# EAGLE design xmosxl (EAGLE 9.6.2)

## Sheet 1 of 9: Overview
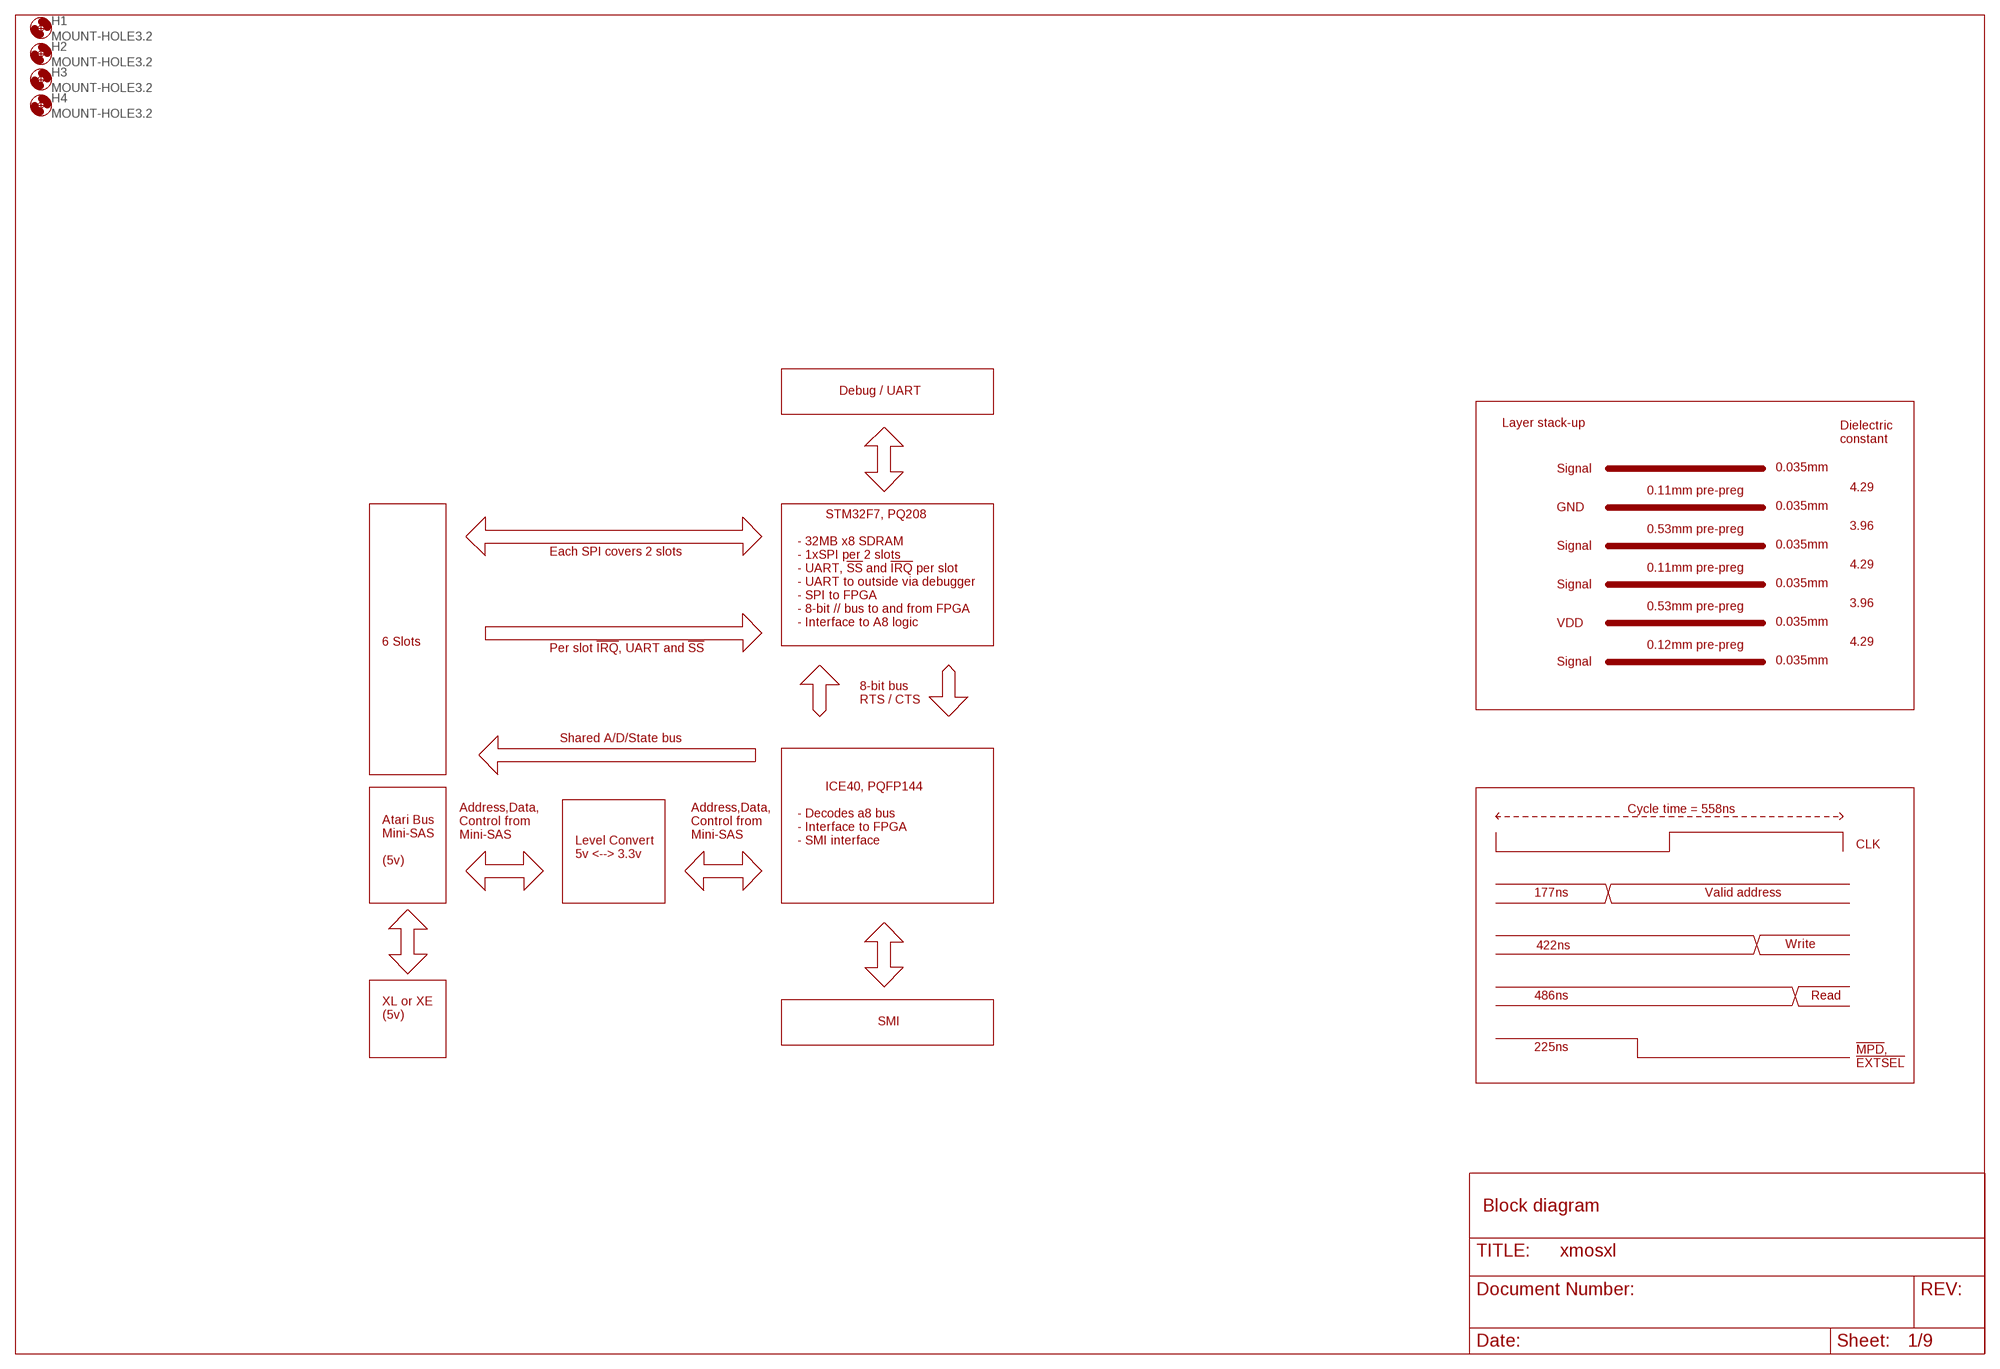
[diagram p0: schematic, sheet 1]

### Parts
H1  MOUNT-HOLE3.2  [3,2]
H2  MOUNT-HOLE3.2  [3,2]
H3  MOUNT-HOLE3.2  [3,2]
H4  MOUNT-HOLE3.2  [3,2]

### Notes on the sheet
- Debug / UART
- Layer stack-up
- Dielectric
  constant
- Signal | 0.035mm
- 0.11mm pre-preg | 4.29
- GND | 0.035mm
- 0.53mm pre-preg | 3.96
- Signal | 0.035mm
- Each SPI covers 2 slots
- 0.11mm pre-preg | 4.29
- Signal | 0.035mm
- 0.53mm pre-preg | 3.96
- 0.035mm
- STM32F7, PQ208
  
   - 32MB x8 SDRAM
   - 1xSPI per 2 slots
   - UART, !SS! and !IRQ! per slot
   - UART to outside via debugger
   - SPI to FPGA
   - 8-bit // bus to and from FPGA
   - Interface to A8 logic
- VDD
- 6 Slots | 0.12mm pre-preg | 4.29
- Per slot !IRQ!, UART and !SS!
- Signal | 0.035mm
- 8-bit bus
  RTS / CTS
- Shared A/D/State bus
- Cycle time = 558ns
- Address,Data,
  Control from
  Mini-SAS
- Address,Data,
  Control from
  Mini-SAS
- CLK
- Level Convert
  5v <--> 3.3v
- ICE40, PQFP144
  
   - Decodes a8 bus
   - Interface to FPGA
   - SMI interface
- Atari Bus
  Mini-SAS
  
  (5v)
- 177ns | Valid address
- 422ns | Write
- 486ns | Read
- XL or XE
  (5v)
- SMI
- 225ns
- !MPD!,
  !EXTSEL!
- Block diagram

## Sheet 2 of 9: A8 i/o
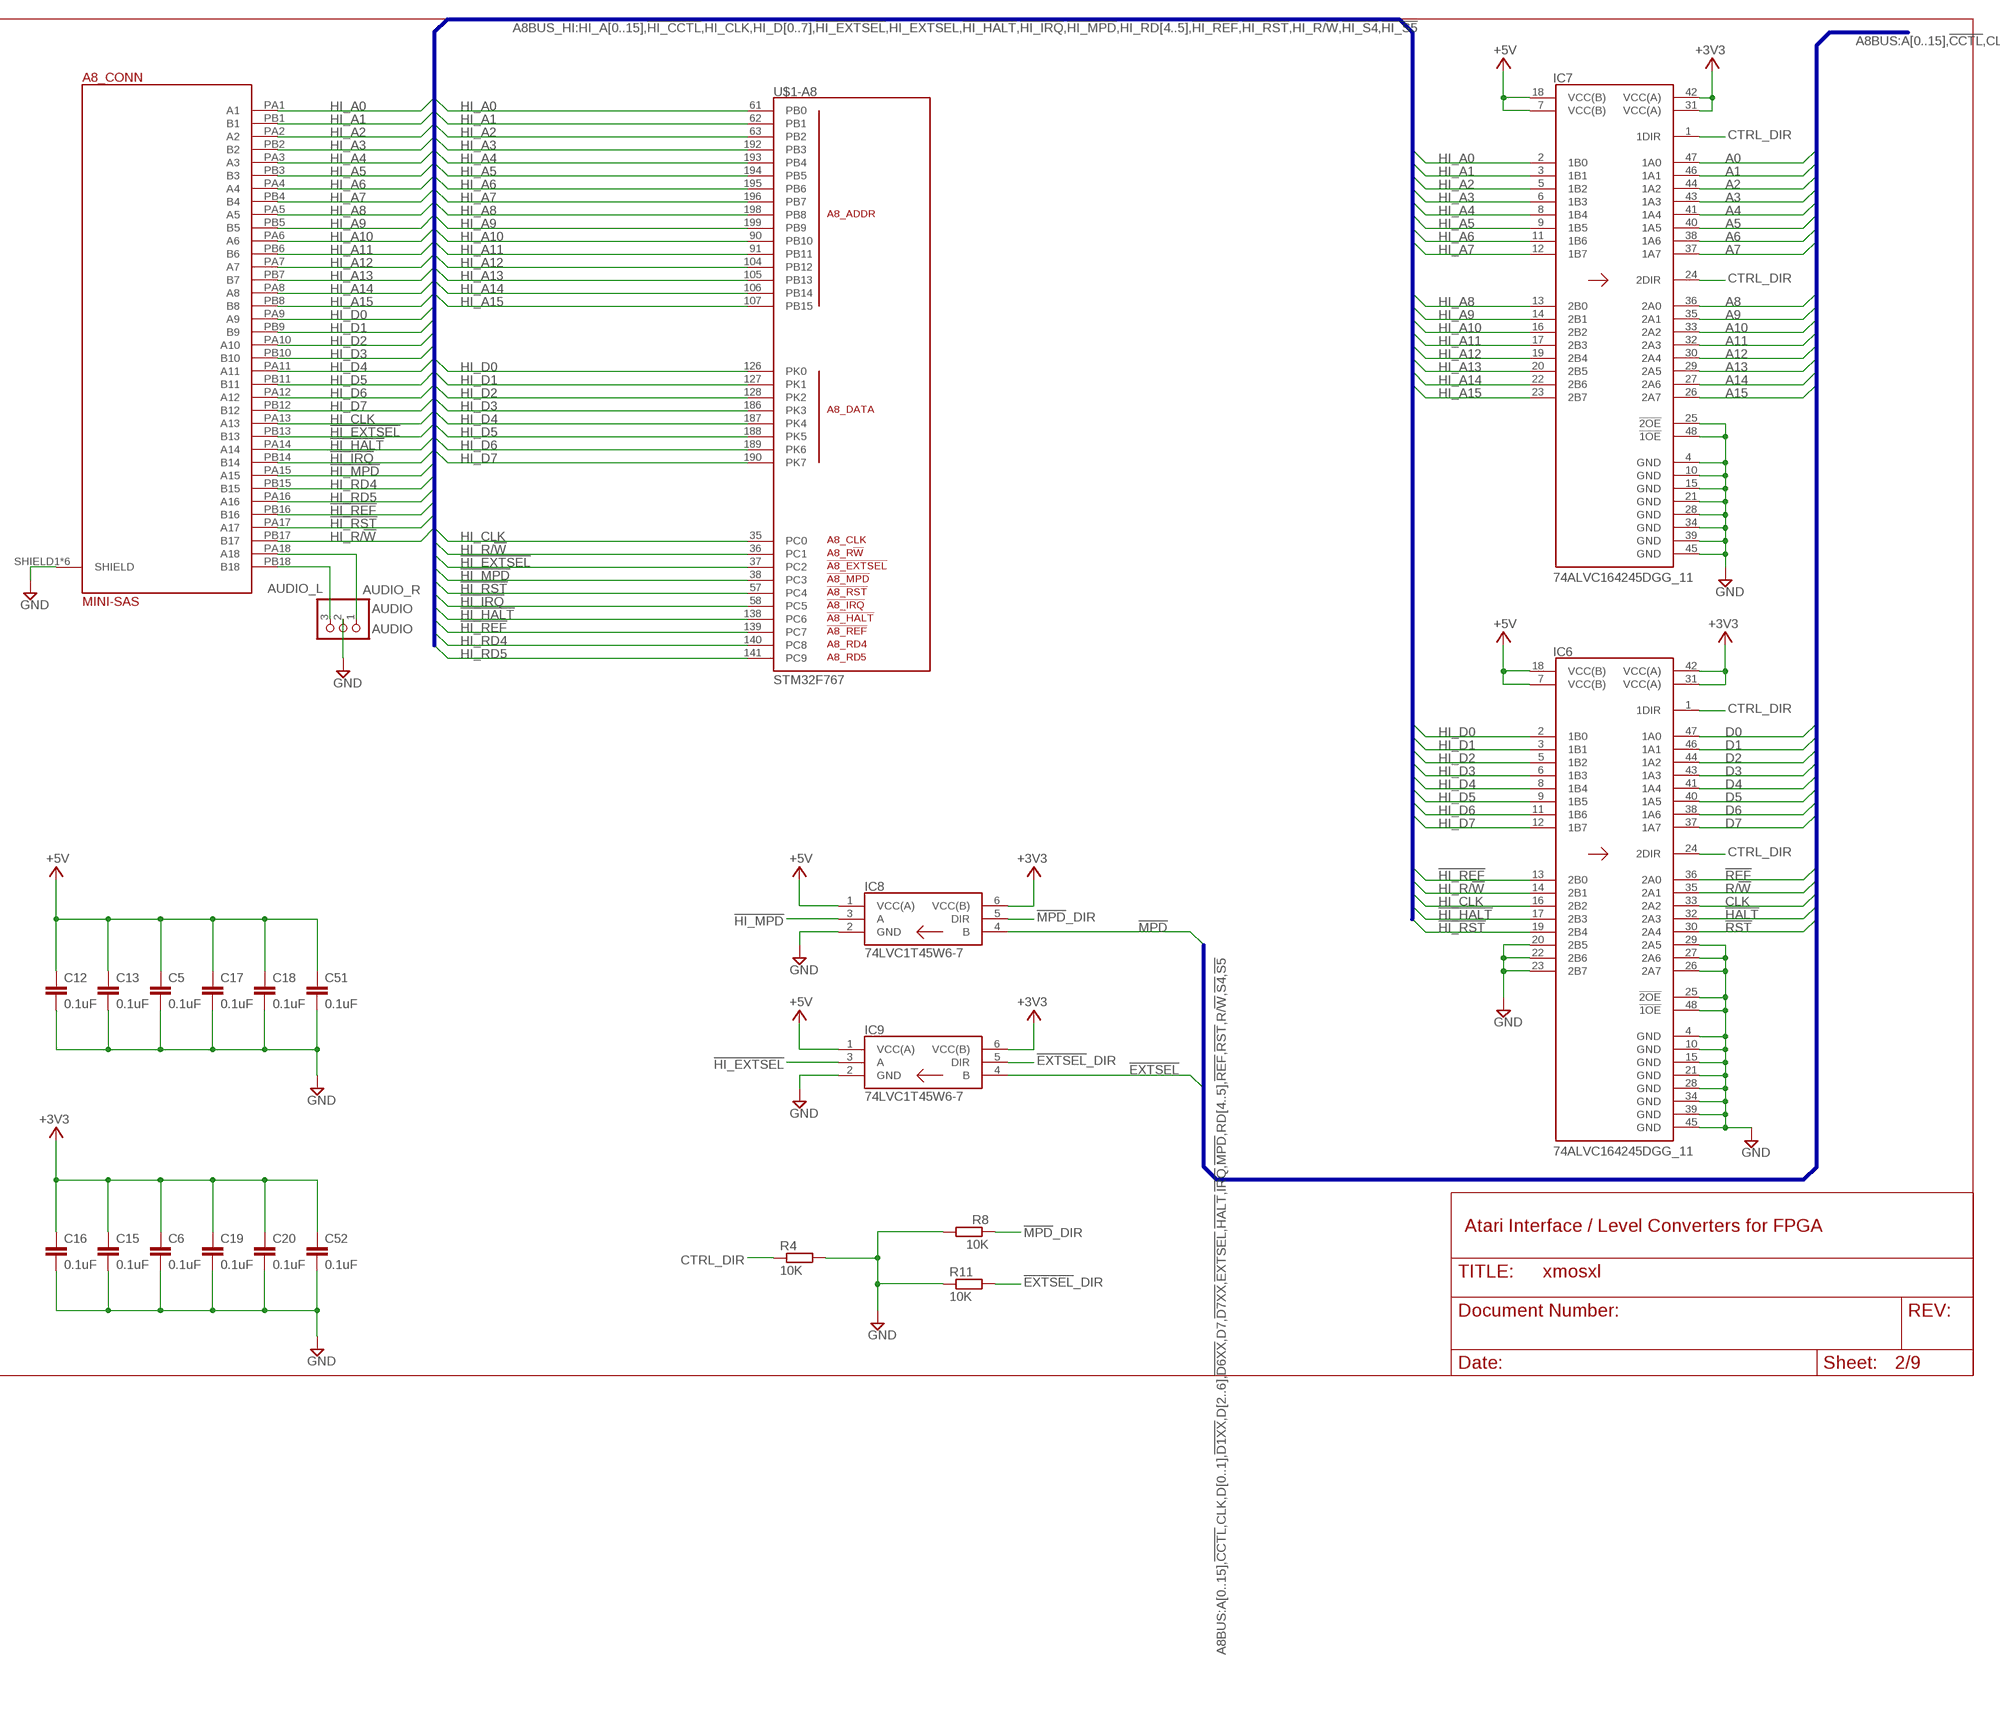
[diagram p1: schematic, sheet 2, part 1 of 2]
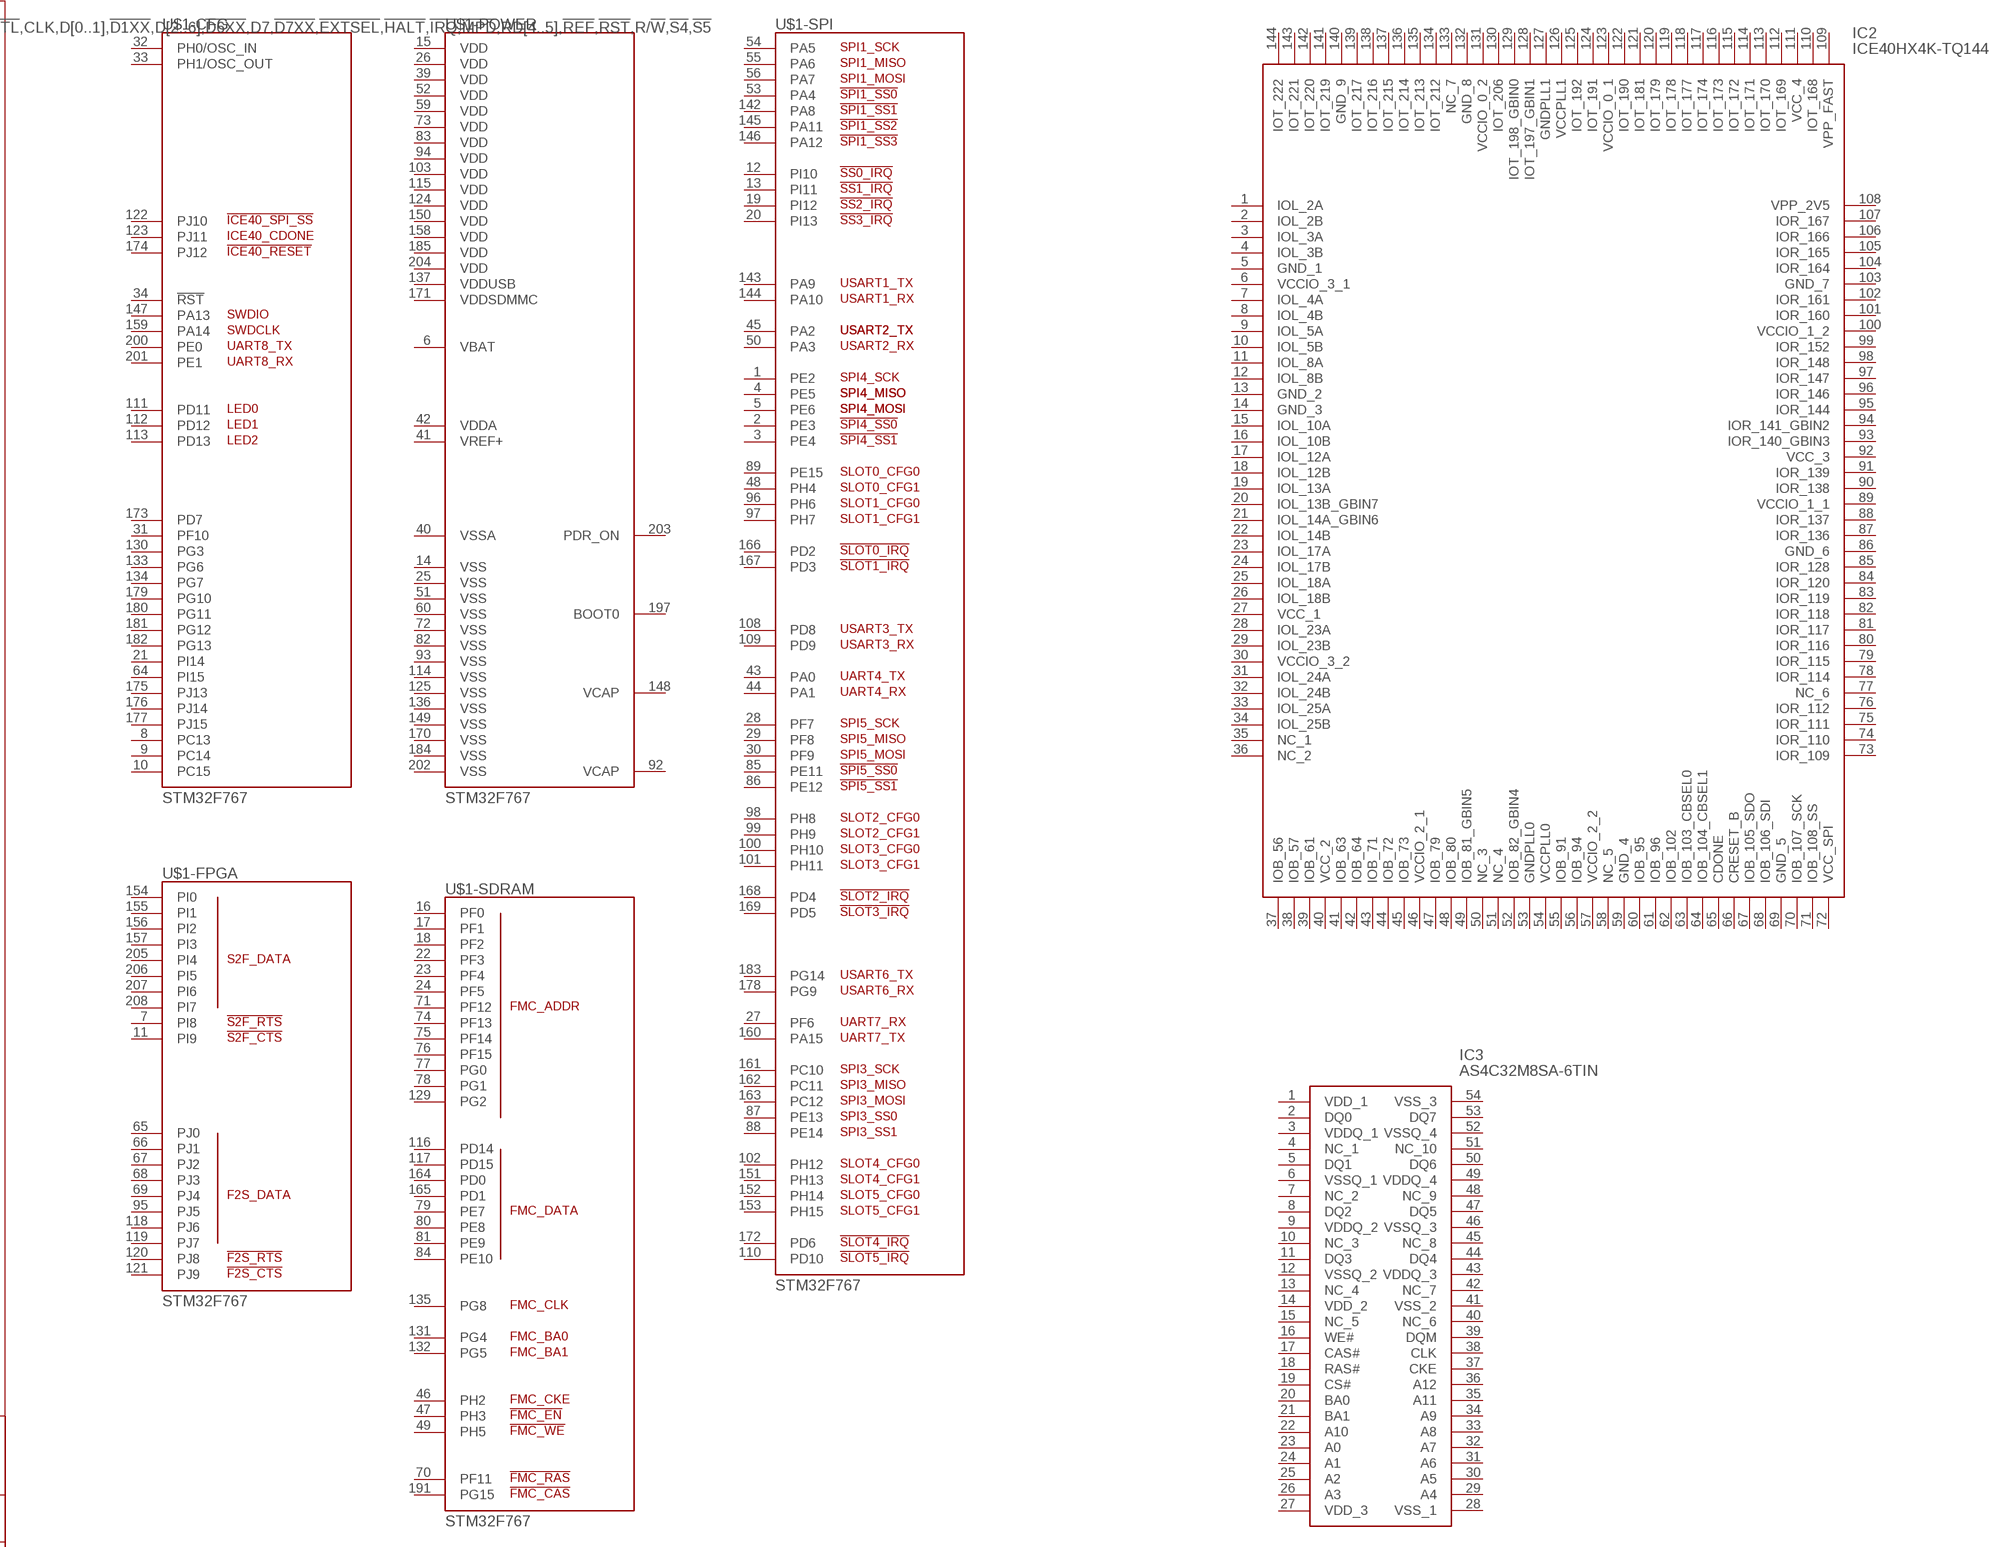
[diagram p2: schematic, sheet 2, part 2 of 2]

### Parts
A8_CONN  MINI-SAS  [MINI-SAS]
AUDIO  AUDIO  PINHD-1X3  [1X03]
C5  0.1uF  C-EUC0201  [C0201]
C6  0.1uF  C-EUC0201  [C0201]
C12  0.1uF  C-EUC0201  [C0201]
C13  0.1uF  C-EUC0201  [C0201]
C15  0.1uF  C-EUC0201  [C0201]
C16  0.1uF  C-EUC0201  [C0201]
C17  0.1uF  C-EUC0201  [C0201]
C18  0.1uF  C-EUC0201  [C0201]
C19  0.1uF  C-EUC0201  [C0201]
C20  0.1uF  C-EUC0201  [C0201]
C51  0.1uF  C-EUC0201  [C0201]
C52  0.1uF  C-EUC0201  [C0201]
IC2  ICE40HX4K-TQ144  [QFP50P2200X2200X160-144N]
IC3  AS4C32M8SA-6TIN  MT48LC32M8A2P-6AG  [SOP80P1176X120-54N]
IC6  74ALVC164245DGG_11  [SOP50P810X120-48N]
IC7  74ALVC164245DGG_11  [SOP50P810X120-48N]
IC8  74LVC1T45W6-7  [SOT95P285X140-6N]
IC9  74LVC1T45W6-7  [SOT95P285X140-6N]
R4  10K  R-EU_R0201  [R0201]
R8  10K  R-EU_R0201  [R0201]
R11  10K  R-EU_R0201  [R0201]
U$1  STM32F767  [QFP50P3000X3000X160-208N]

### Nets
!EXTSEL!: IC9.4(B)
!EXTSEL!_DIR: IC9.5(DIR) R11.2
!HALT!: IC6.32(2A3)
!HI_EXTSEL!: A8_CONN.PB13(B13) IC9.3(A) U$1.37(-A8:PC2)
!HI_HALT!: A8_CONN.PA14(A14) IC6.17(2B3) U$1.138(-A8:PC6)
!HI_IRQ!: A8_CONN.PB14(B14) U$1.58(-A8:PC5)
!HI_MPD!: A8_CONN.PA15(A15) IC8.3(A) U$1.38(-A8:PC3)
!HI_REF!: A8_CONN.PB16(B16) IC6.13(2B0) U$1.139(-A8:PC7)
!HI_RST!: A8_CONN.PA17(A17) IC6.19(2B4) U$1.57(-A8:PC4)
!MPD!: IC8.4(B)
!MPD!_DIR: IC8.5(DIR) R8.1
!REF!: IC6.36(2A0)
!RST!: IC6.30(2A4)
+3V3 [3v power]: C6.1 C15.1 C16.1 C19.1 C20.1 C52.1 IC6.31(VCC(A)) IC6.42(VCC(A)) IC7.31(VCC(A)) IC7.42(VCC(A)) IC8.6(VCC(B)) IC9.6(VCC(B)) ; also sheet 3,4
+5V [5v power]: C5.1 C12.1 C13.1 C17.1 C18.1 C51.1 IC6.7(VCC(B)) IC6.18(VCC(B)) IC7.7(VCC(B)) IC7.18(VCC(B)) IC8.1(VCC(A)) IC9.1(VCC(A)) ; also sheet 3,8,9
A0: IC7.47(1A0)
A1: IC7.46(1A1)
A2: IC7.44(1A2)
A3: IC7.43(1A3)
A4: IC7.41(1A4)
A5: IC7.40(1A5)
A6: IC7.38(1A6)
A7: IC7.37(1A7)
A8: IC7.36(2A0)
A9: IC7.35(2A1)
A10: IC7.33(2A2)
A11: IC7.32(2A3)
A12: IC7.30(2A4)
A13: IC7.29(2A5)
A14: IC7.27(2A6)
A15: IC7.26(2A7)
AUDIO_L: A8_CONN.PB18(B18) AUDIO.3
AUDIO_R: A8_CONN.PA18(A18) AUDIO.1
CLK: IC6.33(2A2)
CTRL_DIR: IC6.1(1DIR) IC6.24(2DIR) IC7.1(1DIR) IC7.24(2DIR) R4.1
D0: IC6.47(1A0)
D1: IC6.46(1A1)
D2: IC6.44(1A2)
D3: IC6.43(1A3)
D4: IC6.41(1A4)
D5: IC6.40(1A5)
D6: IC6.38(1A6)
D7: IC6.37(1A7)
GND: A8_CONN.SHIELD1(SHIELD) A8_CONN.SHIELD2(SHIELD) A8_CONN.SHIELD3(SHIELD) A8_CONN.SHIELD4(SHIELD) A8_CONN.SHIELD5(SHIELD) A8_CONN.SHIELD6(SHIELD) AUDIO.2 C5.2 C6.2 C12.2 C13.2 C15.2 C16.2 C17.2 C18.2 C19.2 C20.2 C51.2 C52.2 IC6.4(GND) IC6.10(GND) IC6.15(GND) IC6.20(2B5) IC6.21(GND) IC6.22(2B6) IC6.23(2B7) IC6.25(!2OE) IC6.26(2A7) IC6.27(2A6) IC6.28(GND) IC6.29(2A5) IC6.34(GND) IC6.39(GND) IC6.45(GND) IC6.48(!1OE) IC7.4(GND) IC7.10(GND) IC7.15(GND) IC7.21(GND) IC7.25(!2OE) IC7.28(GND) IC7.34(GND) IC7.39(GND) IC7.45(GND) IC7.48(!1OE) IC8.2(GND) IC9.2(GND) R4.2 R8.2 R11.1 ; also sheet 3,4
HI_A0: A8_CONN.PA1(A1) IC7.2(1B0) U$1.61(-A8:PB0)
HI_A1: A8_CONN.PB1(B1) IC7.3(1B1) U$1.62(-A8:PB1)
HI_A2: A8_CONN.PA2(A2) IC7.5(1B2) U$1.63(-A8:PB2)
HI_A3: A8_CONN.PB2(B2) IC7.6(1B3) U$1.192(-A8:PB3)
HI_A4: A8_CONN.PA3(A3) IC7.8(1B4) U$1.193(-A8:PB4)
HI_A5: A8_CONN.PB3(B3) IC7.9(1B5) U$1.194(-A8:PB5)
HI_A6: A8_CONN.PA4(A4) IC7.11(1B6) U$1.195(-A8:PB6)
HI_A7: A8_CONN.PB4(B4) IC7.12(1B7) U$1.196(-A8:PB7)
HI_A8: A8_CONN.PA5(A5) IC7.13(2B0) U$1.198(-A8:PB8)
HI_A9: A8_CONN.PB5(B5) IC7.14(2B1) U$1.199(-A8:PB9)
HI_A10: A8_CONN.PA6(A6) IC7.16(2B2) U$1.90(-A8:PB10)
HI_A11: A8_CONN.PB6(B6) IC7.17(2B3) U$1.91(-A8:PB11)
HI_A12: A8_CONN.PA7(A7) IC7.19(2B4) U$1.104(-A8:PB12)
HI_A13: A8_CONN.PB7(B7) IC7.20(2B5) U$1.105(-A8:PB13)
HI_A14: A8_CONN.PA8(A8) IC7.22(2B6) U$1.106(-A8:PB14)
HI_A15: A8_CONN.PB8(B8) IC7.23(2B7) U$1.107(-A8:PB15)
HI_CLK: A8_CONN.PA13(A13) IC6.16(2B2) U$1.35(-A8:PC0)
HI_D0: A8_CONN.PA9(A9) IC6.2(1B0) U$1.126(-A8:PK0)
HI_D1: A8_CONN.PB9(B9) IC6.3(1B1) U$1.127(-A8:PK1)
HI_D2: A8_CONN.PA10(A10) IC6.5(1B2) U$1.128(-A8:PK2)
HI_D3: A8_CONN.PB10(B10) IC6.6(1B3) U$1.186(-A8:PK3)
HI_D4: A8_CONN.PA11(A11) IC6.8(1B4) U$1.187(-A8:PK4)
HI_D5: A8_CONN.PB11(B11) IC6.9(1B5) U$1.188(-A8:PK5)
HI_D6: A8_CONN.PA12(A12) IC6.11(1B6) U$1.189(-A8:PK6)
HI_D7: A8_CONN.PB12(B12) IC6.12(1B7) U$1.190(-A8:PK7)
HI_R/!W!: A8_CONN.PB17(B17) IC6.14(2B1) U$1.36(-A8:PC1)
HI_RD4: A8_CONN.PB15(B15) U$1.140(-A8:PC8)
HI_RD5: A8_CONN.PA16(A16) U$1.141(-A8:PC9)
R/!W!: IC6.35(2A1)
Unconnected: IC2.1(IOL_2A) IC2.2(IOL_2B) IC2.3(IOL_3A) IC2.4(IOL_3B) IC2.5(GND_1) IC2.6(VCCIO_3_1) IC2.7(IOL_4A) IC2.8(IOL_4B) IC2.9(IOL_5A) IC2.10(IOL_5B) IC2.11(IOL_8A) IC2.12(IOL_8B) IC2.13(GND_2) IC2.14(GND_3) IC2.15(IOL_10A) IC2.16(IOL_10B) IC2.17(IOL_12A) IC2.18(IOL_12B) IC2.19(IOL_13A) IC2.20(IOL_13B_GBIN7) IC2.21(IOL_14A_GBIN6) IC2.22(IOL_14B) IC2.23(IOL_17A) IC2.24(IOL_17B) IC2.25(IOL_18A) IC2.26(IOL_18B) IC2.27(VCC_1) IC2.28(IOL_23A) IC2.29(IOL_23B) IC2.30(VCCIO_3_2) IC2.31(IOL_24A) IC2.32(IOL_24B) IC2.33(IOL_25A) IC2.34(IOL_25B) IC2.35(NC_1) IC2.36(NC_2) IC2.37(IOB_56) IC2.38(IOB_57) IC2.39(IOB_61) IC2.40(VCC_2) IC2.41(IOB_63) IC2.42(IOB_64) IC2.43(IOB_71) IC2.44(IOB_72) IC2.45(IOB_73) IC2.46(VCCIO_2_1) IC2.47(IOB_79) IC2.48(IOB_80) IC2.49(IOB_81_GBIN5) IC2.50(NC_3) IC2.51(NC_4) IC2.52(IOB_82_GBIN4) IC2.53(GNDPLL0) IC2.54(VCCPLL0) IC2.55(IOB_91) IC2.56(IOB_94) IC2.57(VCCIO_2_2) IC2.58(NC_5) IC2.59(GND_4) IC2.60(IOB_95) IC2.61(IOB_96) IC2.62(IOB_102) IC2.63(IOB_103_CBSEL0) IC2.64(IOB_104_CBSEL1) IC2.65(CDONE) IC2.66(CRESET_B) IC2.67(IOB_105_SDO) IC2.68(IOB_106_SDI) IC2.69(GND_5) IC2.70(IOB_107_SCK) IC2.71(IOB_108_SS) IC2.72(VCC_SPI) IC2.73(IOR_109) IC2.74(IOR_110) IC2.75(IOR_111) IC2.76(IOR_112) IC2.77(NC_6) IC2.78(IOR_114) IC2.79(IOR_115) IC2.80(IOR_116) IC2.81(IOR_117) IC2.82(IOR_118) IC2.83(IOR_119) IC2.84(IOR_120) IC2.85(IOR_128) IC2.86(GND_6) IC2.87(IOR_136) IC2.88(IOR_137) IC2.89(VCCIO_1_1) IC2.90(IOR_138) IC2.91(IOR_139) IC2.92(VCC_3) IC2.93(IOR_140_GBIN3) IC2.94(IOR_141_GBIN2) IC2.95(IOR_144) IC2.96(IOR_146) IC2.97(IOR_147) IC2.98(IOR_148) IC2.99(IOR_152) IC2.100(VCCIO_1_2) IC2.101(IOR_160) IC2.102(IOR_161) IC2.103(GND_7) IC2.104(IOR_164) IC2.105(IOR_165) IC2.106(IOR_166) IC2.107(IOR_167) IC2.108(VPP_2V5) IC2.109(VPP_FAST) IC2.110(IOT_168) IC2.111(VCC_4) IC2.112(IOT_169) IC2.113(IOT_170) IC2.114(IOT_171) IC2.115(IOT_172) IC2.116(IOT_173) IC2.117(IOT_174) IC2.118(IOT_177) IC2.119(IOT_178) IC2.120(IOT_179) IC2.121(IOT_181) IC2.122(IOT_190) IC2.123(VCCIO_0_1) IC2.124(IOT_191) IC2.125(IOT_192) IC2.126(VCCPLL1) IC2.127(GNDPLL1) IC2.128(IOT_197_GBIN1) IC2.129(IOT_198_GBIN0) IC2.130(IOT_206) IC2.131(VCCIO_0_2) IC2.132(GND_8) IC2.133(NC_7) IC2.134(IOT_212) IC2.135(IOT_213) IC2.136(IOT_214) IC2.137(IOT_215) IC2.138(IOT_216) IC2.139(IOT_217) IC2.140(GND_9) IC2.141(IOT_219) IC2.142(IOT_220) IC2.143(IOT_221) IC2.144(IOT_222) IC3.1(VDD_1) IC3.2(DQ0) IC3.3(VDDQ_1) IC3.4(NC_1) IC3.5(DQ1) IC3.6(VSSQ_1) IC3.7(NC_2) IC3.8(DQ2) IC3.9(VDDQ_2) IC3.10(NC_3) IC3.11(DQ3) IC3.12(VSSQ_2) IC3.13(NC_4) IC3.14(VDD_2) IC3.15(NC_5) IC3.16(WE#) IC3.17(CAS#) IC3.18(RAS#) IC3.19(CS#) IC3.20(BA0) IC3.21(BA1) IC3.22(A10) IC3.23(A0) IC3.24(A1) IC3.25(A2) IC3.26(A3) IC3.27(VDD_3) IC3.28(VSS_1) IC3.29(A4) IC3.30(A5) IC3.31(A6) IC3.32(A7) IC3.33(A8) IC3.34(A9) IC3.35(A11) IC3.36(A12) IC3.37(CKE) IC3.38(CLK) IC3.39(DQM) IC3.40(NC_6) IC3.41(VSS_2) IC3.42(NC_7) IC3.43(VDDQ_3) IC3.44(DQ4) IC3.45(NC_8) IC3.46(VSSQ_3) IC3.47(DQ5) IC3.48(NC_9) IC3.49(VDDQ_4) IC3.50(DQ6) IC3.51(NC_10) IC3.52(VSSQ_4) IC3.53(DQ7) IC3.54(VSS_3) U$1.1(-SPI:PE2) U$1.2(-SPI:PE3) U$1.3(-SPI:PE4) U$1.4(-SPI:PE5) U$1.5(-SPI:PE6) U$1.7(-FPGA:PI8) U$1.8(-CFG:PC13) U$1.9(-CFG:PC14) U$1.10(-CFG:PC15) U$1.11(-FPGA:PI9) U$1.12(-SPI:PI10) U$1.13(-SPI:PI11) U$1.16(-SDRAM:PF0) U$1.17(-SDRAM:PF1) U$1.18(-SDRAM:PF2) U$1.19(-SPI:PI12) U$1.20(-SPI:PI13) U$1.21(-CFG:PI14) U$1.22(-SDRAM:PF3) U$1.23(-SDRAM:PF4) U$1.24(-SDRAM:PF5) U$1.27(-SPI:PF6) U$1.28(-SPI:PF7) U$1.29(-SPI:PF8) U$1.30(-SPI:PF9) U$1.31(-CFG:PF10) U$1.32(-CFG:PH0/OSC_IN) U$1.33(-CFG:PH1/OSC_OUT) U$1.34(-CFG:!RST!) U$1.43(-SPI:PA0) U$1.44(-SPI:PA1) U$1.45(-SPI:PA2) U$1.46(-SDRAM:PH2) U$1.47(-SDRAM:PH3) U$1.48(-SPI:PH4) U$1.49(-SDRAM:PH5) U$1.50(-SPI:PA3) U$1.53(-SPI:PA4) U$1.54(-SPI:PA5) U$1.55(-SPI:PA6) U$1.56(-SPI:PA7) U$1.64(-CFG:PI15) U$1.65(-FPGA:PJ0) U$1.66(-FPGA:PJ1) U$1.67(-FPGA:PJ2) U$1.68(-FPGA:PJ3) U$1.69(-FPGA:PJ4) U$1.70(-SDRAM:PF11) U$1.71(-SDRAM:PF12) U$1.74(-SDRAM:PF13) U$1.75(-SDRAM:PF14) U$1.76(-SDRAM:PF15) U$1.77(-SDRAM:PG0) U$1.78(-SDRAM:PG1) U$1.79(-SDRAM:PE7) U$1.80(-SDRAM:PE8) U$1.81(-SDRAM:PE9) U$1.84(-SDRAM:PE10) U$1.85(-SPI:PE11) U$1.86(-SPI:PE12) U$1.87(-SPI:PE13) U$1.88(-SPI:PE14) U$1.89(-SPI:PE15) U$1.95(-FPGA:PJ5) U$1.96(-SPI:PH6) U$1.97(-SPI:PH7) U$1.98(-SPI:PH8) U$1.99(-SPI:PH9) U$1.100(-SPI:PH10) U$1.101(-SPI:PH11) U$1.102(-SPI:PH12) U$1.108(-SPI:PD8) U$1.109(-SPI:PD9) U$1.110(-SPI:PD10) U$1.111(-CFG:PD11) U$1.112(-CFG:PD12) U$1.113(-CFG:PD13) U$1.116(-SDRAM:PD14) U$1.117(-SDRAM:PD15) U$1.118(-FPGA:PJ6) U$1.119(-FPGA:PJ7) U$1.120(-FPGA:PJ8) U$1.121(-FPGA:PJ9) U$1.122(-CFG:PJ10) U$1.123(-CFG:PJ11) U$1.129(-SDRAM:PG2) U$1.130(-CFG:PG3) U$1.131(-SDRAM:PG4) U$1.132(-SDRAM:PG5) U$1.133(-CFG:PG6) U$1.134(-CFG:PG7) U$1.135(-SDRAM:PG8) U$1.142(-SPI:PA8) U$1.143(-SPI:PA9) U$1.144(-SPI:PA10) U$1.145(-SPI:PA11) U$1.146(-SPI:PA12) U$1.147(-CFG:PA13) U$1.151(-SPI:PH13) U$1.152(-SPI:PH14) U$1.153(-SPI:PH15) U$1.154(-FPGA:PI0) U$1.155(-FPGA:PI1) U$1.156(-FPGA:PI2) U$1.157(-FPGA:PI3) U$1.159(-CFG:PA14) U$1.160(-SPI:PA15) U$1.161(-SPI:PC10) U$1.162(-SPI:PC11) U$1.163(-SPI:PC12) U$1.164(-SDRAM:PD0) U$1.165(-SDRAM:PD1) U$1.166(-SPI:PD2) U$1.167(-SPI:PD3) U$1.168(-SPI:PD4) U$1.169(-SPI:PD5) U$1.172(-SPI:PD6) U$1.173(-CFG:PD7) U$1.174(-CFG:PJ12) U$1.175(-CFG:PJ13) U$1.176(-CFG:PJ14) U$1.177(-CFG:PJ15) U$1.178(-SPI:PG9) U$1.179(-CFG:PG10) U$1.180(-CFG:PG11) U$1.181(-CFG:PG12) U$1.182(-CFG:PG13) U$1.183(-SPI:PG14) U$1.191(-SDRAM:PG15) U$1.197(-POWER:BOOT0) U$1.200(-CFG:PE0) U$1.201(-CFG:PE1) U$1.203(-POWER:PDR_ON) U$1.205(-FPGA:PI4) U$1.206(-FPGA:PI5) U$1.207(-FPGA:PI6) U$1.208(-FPGA:PI7)

### Buses
A8BUS_HI:HI_A[0..15],!HI_CCTL!,HI_CLK,HI_D[0..7],!HI_EXTSEL!,HI_EXTSEL,!HI_HALT!,!HI_IRQ!,!HI_MPD!,HI_RD[4..5],!HI_REF!,!HI_RST!,HI_R/!W!,!HI_S4!,!HI_S5!
A8BUS:A[0..15],!CCTL!,CLK,D[0..1],!D1XX!,D[2..6],!D6XX!,D7,!D7XX!,!EXTSEL!,!HALT!,!IRQ!,!MPD!,RD[4..5],!REF!,!RST!,R/!W!,!S4!,!S5!

### Notes on the sheet
- Atari Interface / Level Converters for FPGA

## Sheet 3 of 9: XMOS Power
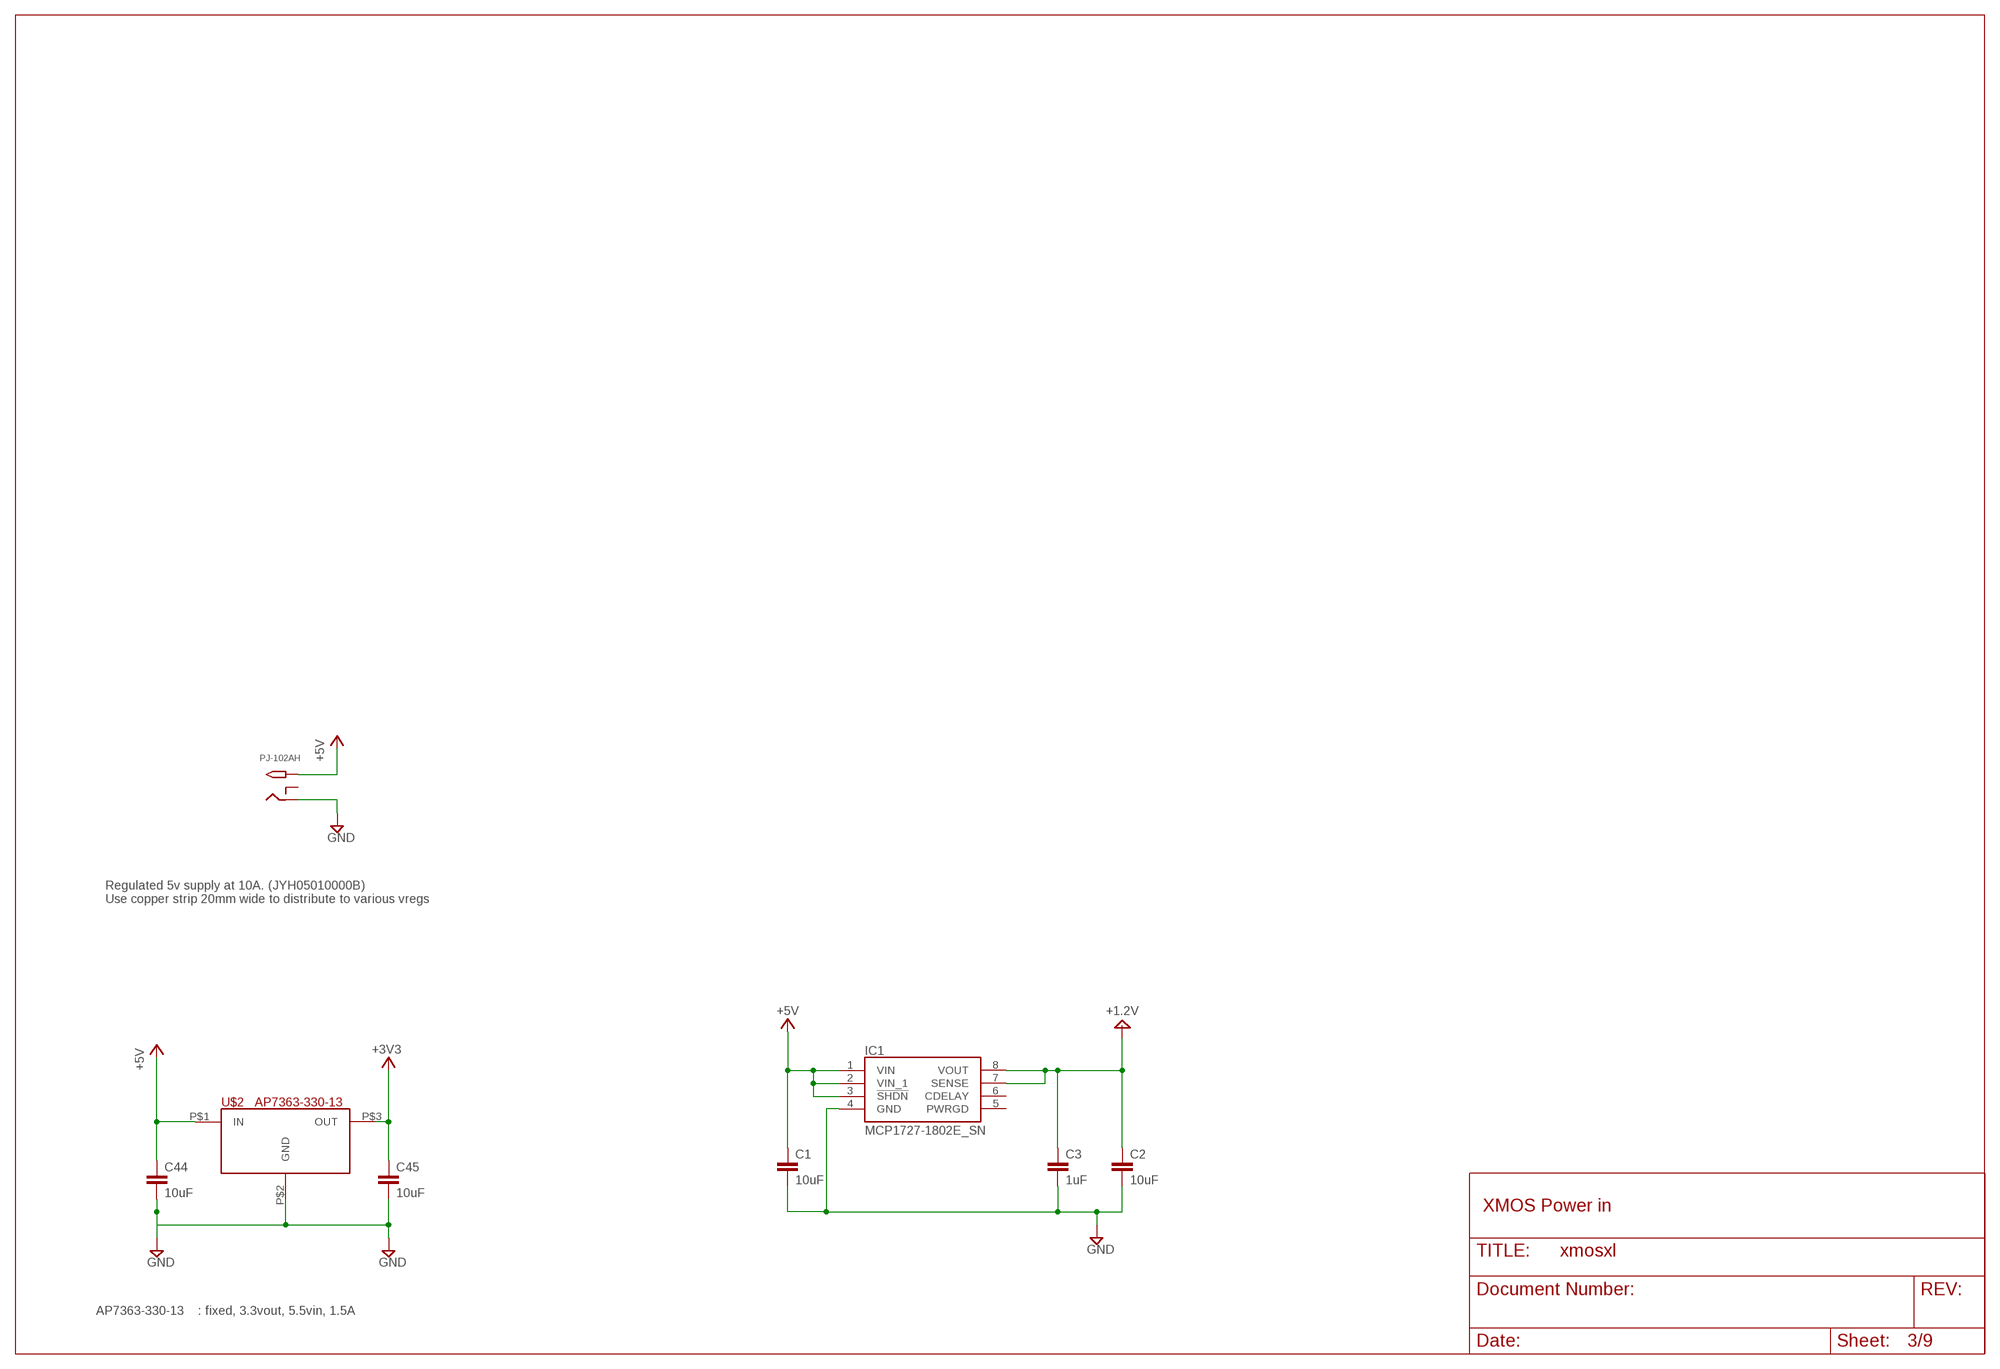
[diagram p3: schematic, sheet 3]

### Parts
C1  10uF  C-EUC0402K  [C0402K]
C2  10uF  C-EUC0402K  [C0402K]
C3  1uF  C-EUC0201  [C0201]
C44  10uF  C-EUC0402K  [C0402K]
C45  10uF  C-EUC0402K  [C0402K]
IC1  MCP1727-1802E_SN  [SOIC127P600X175-8N]
PJ-102AH  PJ-102AH  2.1MMJACKTHM  [PJ-102A]
U$2  AP7363-330-13  AP7363  [TO252-3L]

### Nets
+1.2V: C2.1 C3.1 IC1.7(SENSE) IC1.8(VOUT)
+3V3 [3v power]: C45.1 U$2.P$3(OUT) ; also sheet 2,4
+5V [5v power]: C1.1 C44.1 IC1.1(VIN) IC1.2(VIN_1) IC1.3(!SHDN) PJ-102AH.TIP U$2.P$1(IN) ; also sheet 2,8,9
GND: C1.2 C2.2 C3.2 C44.2 C45.2 IC1.4(GND) PJ-102AH.RING U$2.P$2(GND) ; also sheet 2,4
Unconnected: IC1.5(PWRGD) IC1.6(CDELAY) PJ-102AH.RING_SW

### Notes on the sheet
- Regulated 5v supply at 10A. (JYH05010000B)
  Use copper strip 20mm wide to distribute to various vregs
- XMOS Power in
- AP7363-330-13    : fixed, 3.3vout, 5.5vin, 1.5A

## Sheet 4 of 9: XMOS control/config
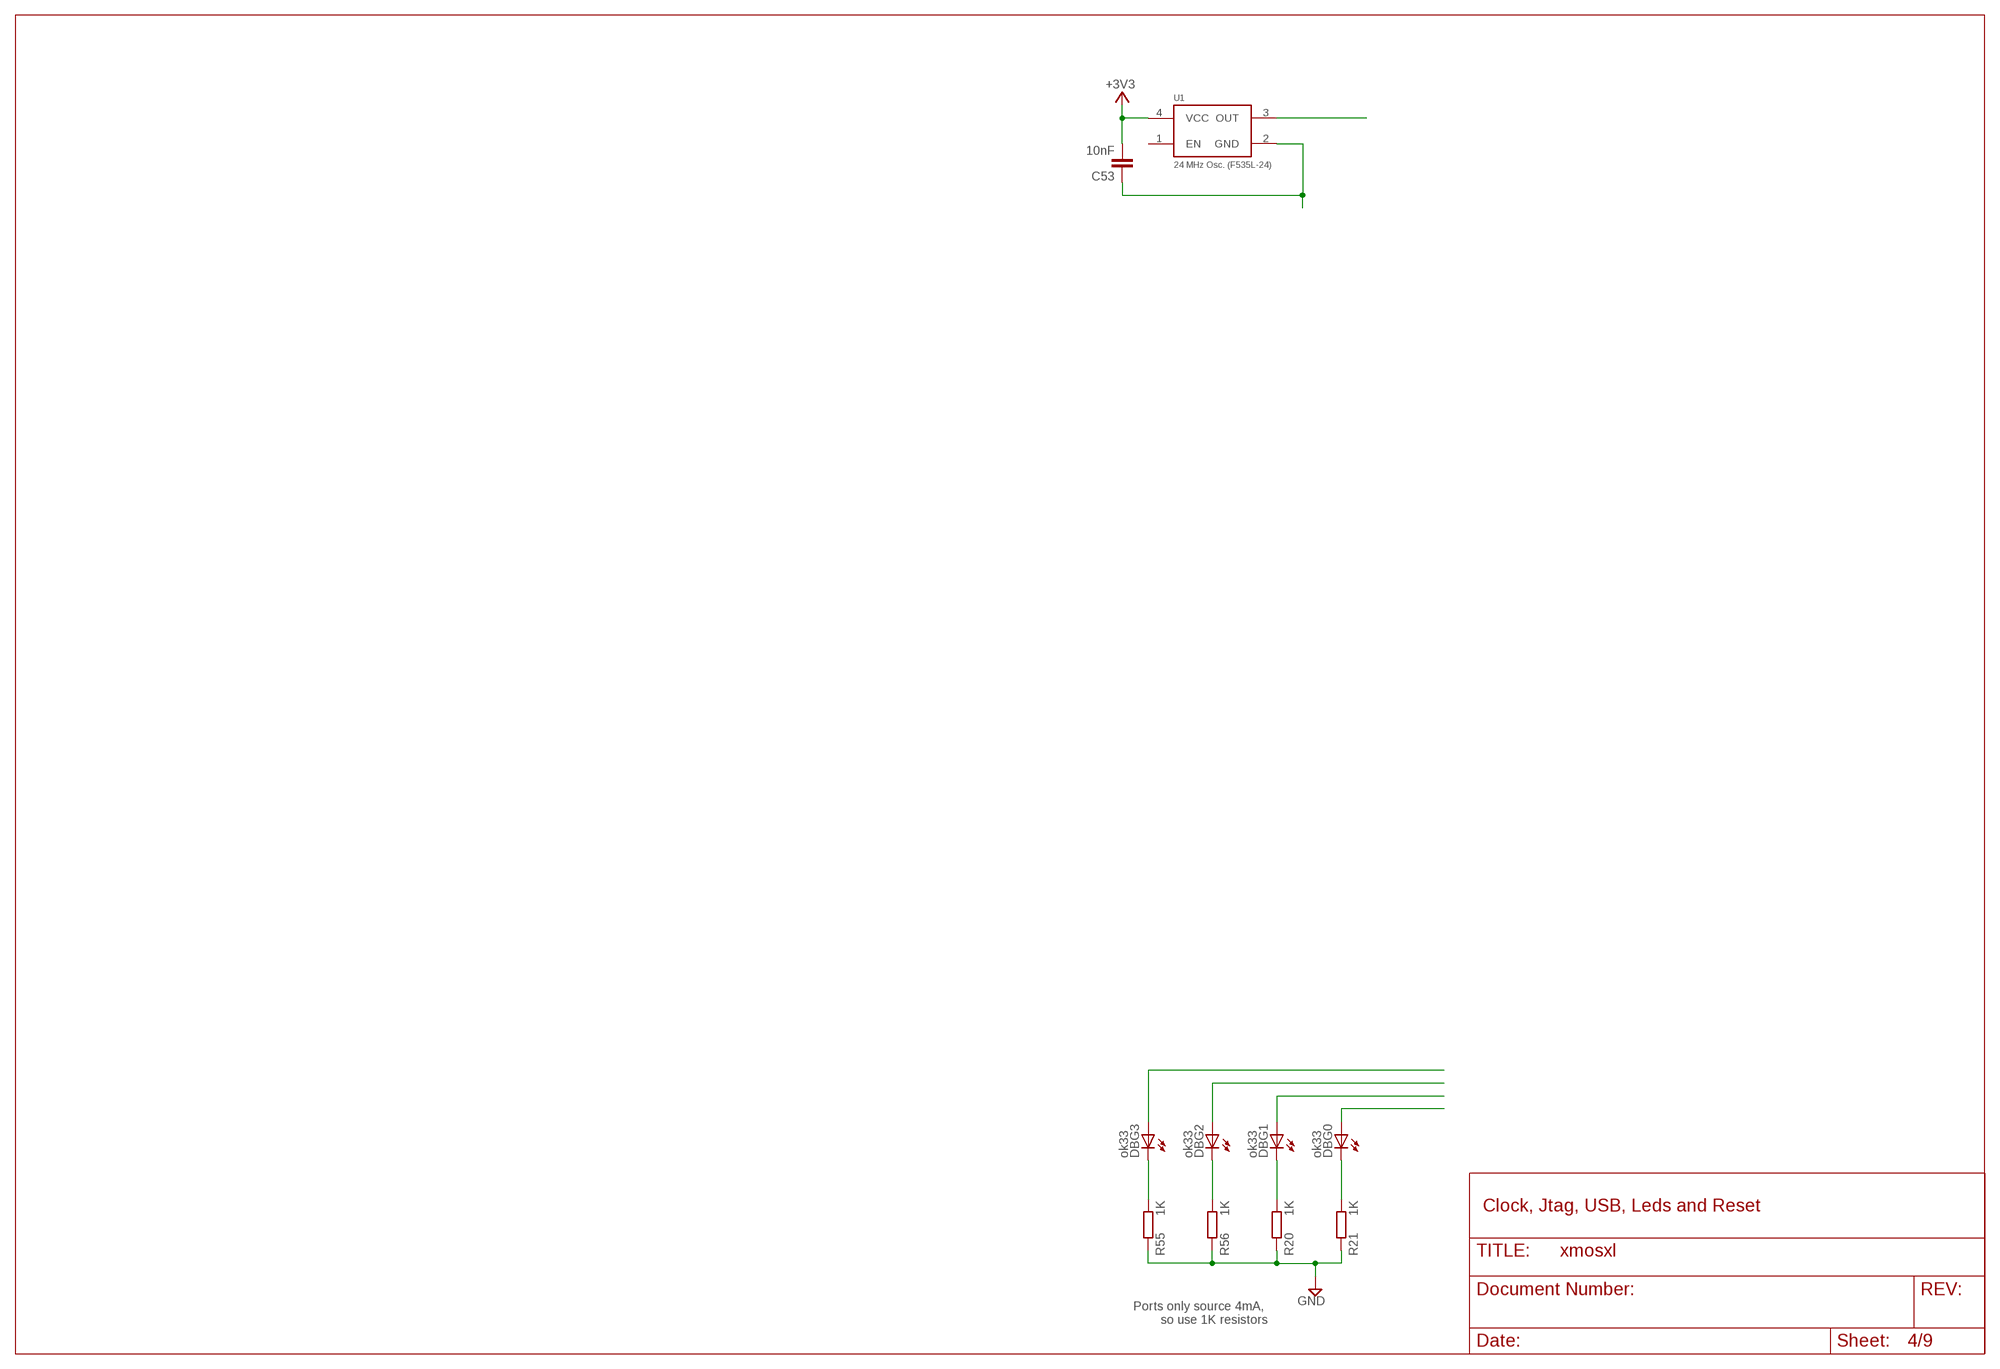
[diagram p4: schematic, sheet 4]

### Parts
C53  10nF  C-EUC0201  [C0201]
DBG0  ok33  LEDCHIP-LED0603  [CHIP-LED0603]
DBG1  ok33  LEDCHIP-LED0603  [CHIP-LED0603]
DBG2  ok33  LEDCHIP-LED0603  [CHIP-LED0603]
DBG3  ok33  LEDCHIP-LED0603  [CHIP-LED0603]
R20  1K  R-EU_R0201  [R0201]
R21  1K  R-EU_R0201  [R0201]
R55  1K  R-EU_R0201  [R0201]
R56  1K  R-EU_R0201  [R0201]
U1  24 MHz Osc. (F535L-24)  OSCILLATOR5X3-PIN1-INDICATED  [CRYSTAL-OSC-SMD-5X3]

### Nets
+3V3 [3v power]: C53.2 U1.4(VCC) ; also sheet 2,3
GND: R20.1 R21.1 R55.1 R56.1 ; also sheet 2,3
N$2: U1.3(OUT)
N$3: DBG2.C R56.2
N$4: DBG0.A
N$16: DBG0.C R21.2
N$18: DBG3.C R55.2
N$19: DBG1.C R20.2
N$33: C53.1 U1.2(GND)
N$56: DBG1.A
N$57: DBG2.A
N$63: DBG3.A
Unconnected: U1.1(EN)

### Notes on the sheet
- Clock, Jtag, USB, Leds and Reset
- Ports only source 4mA, 
  so use 1K resistors

## Sheet 5 of 9: A8 to XMOS
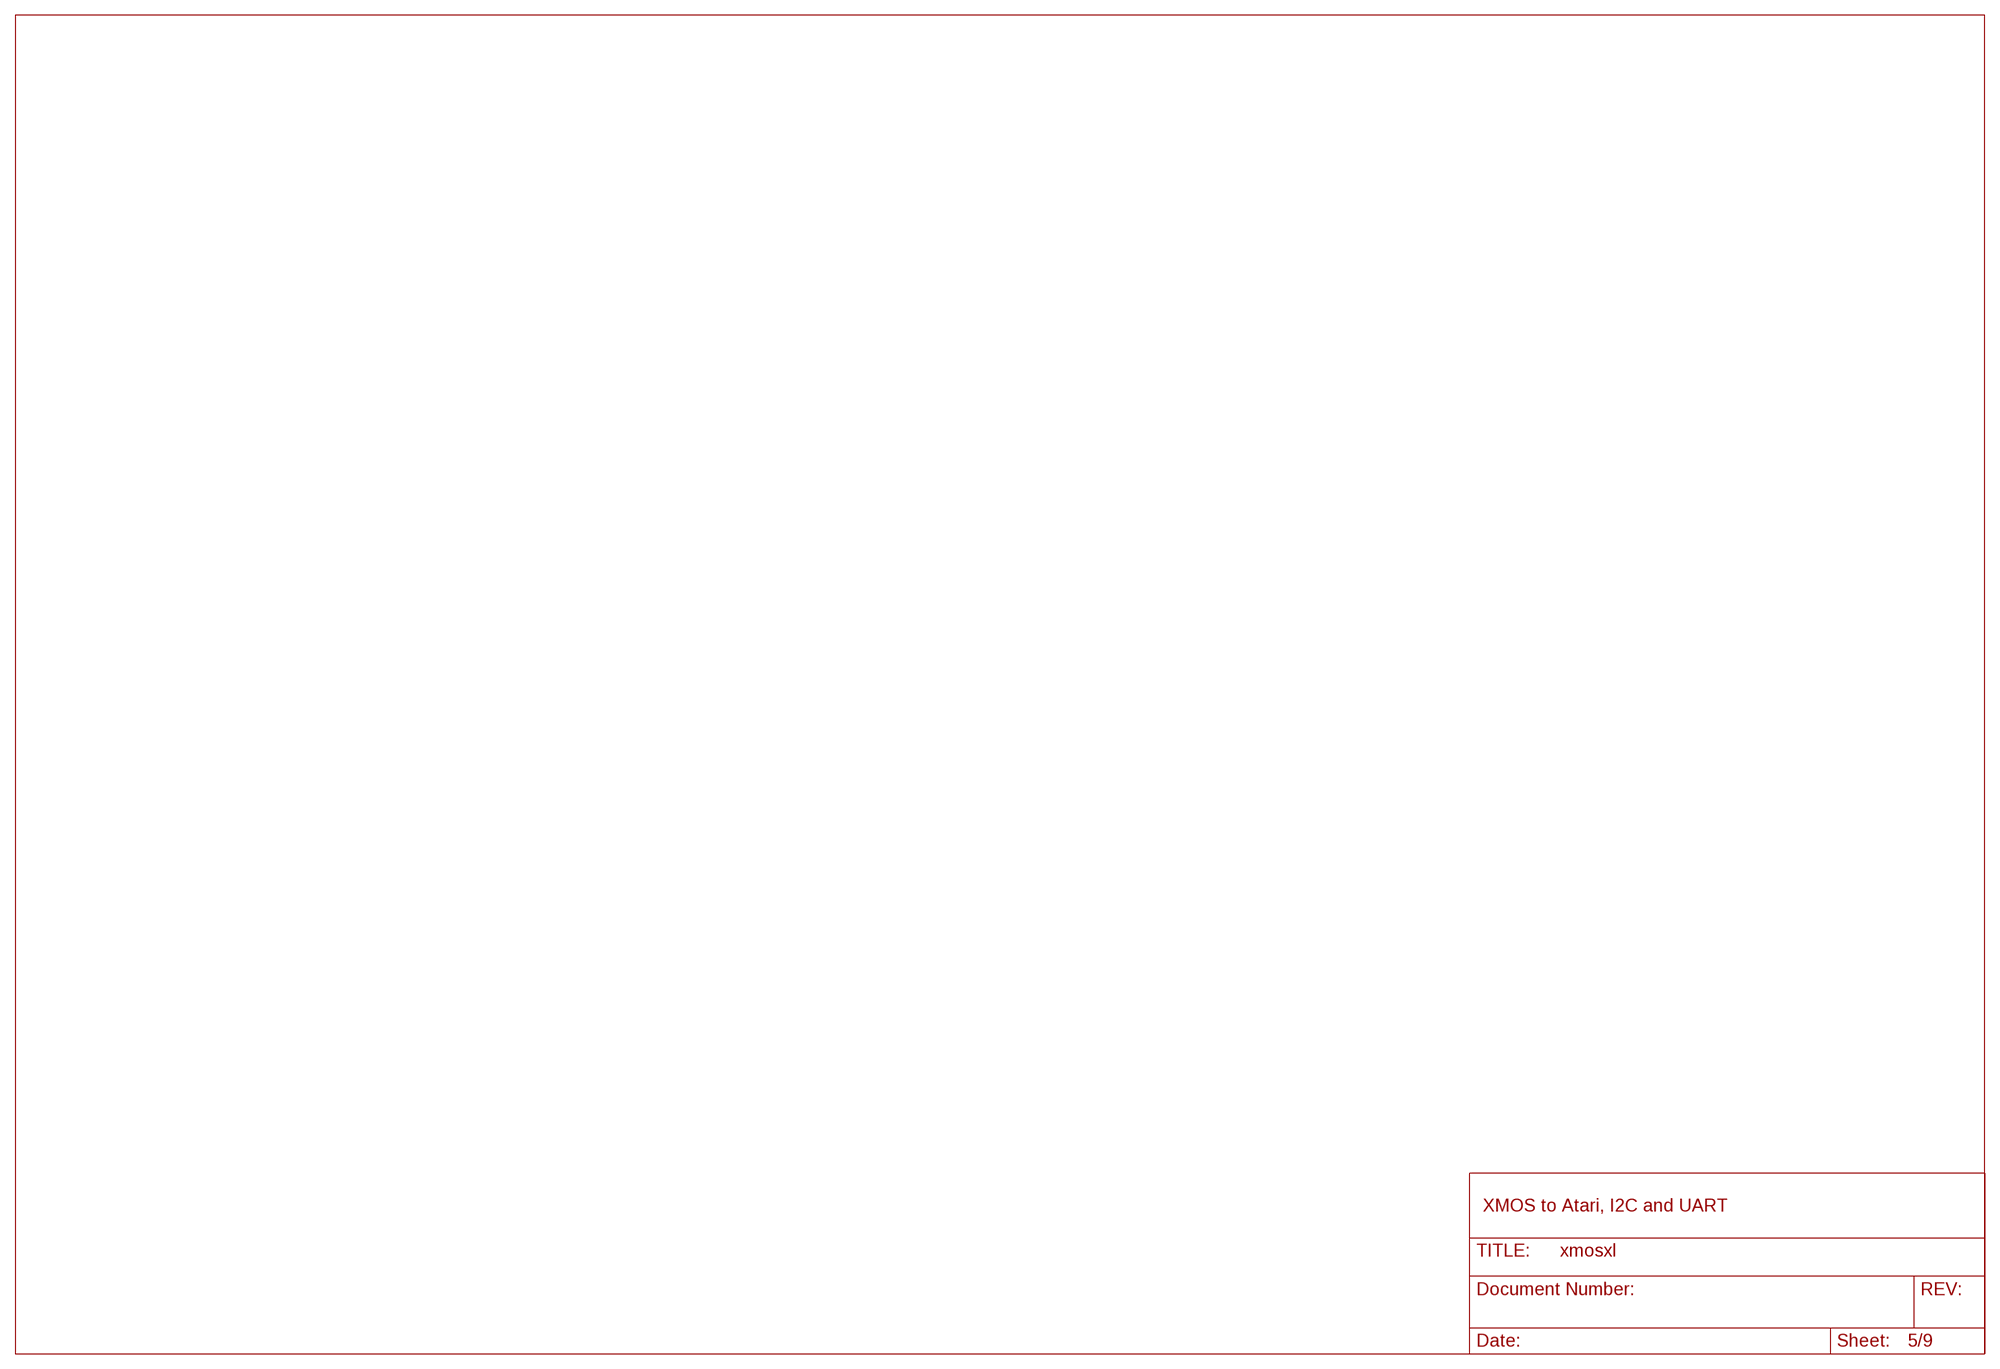
[diagram p5: schematic, sheet 5]

### Notes on the sheet
- XMOS to Atari, I2C and UART

## Sheet 6 of 9: XMOS Memory
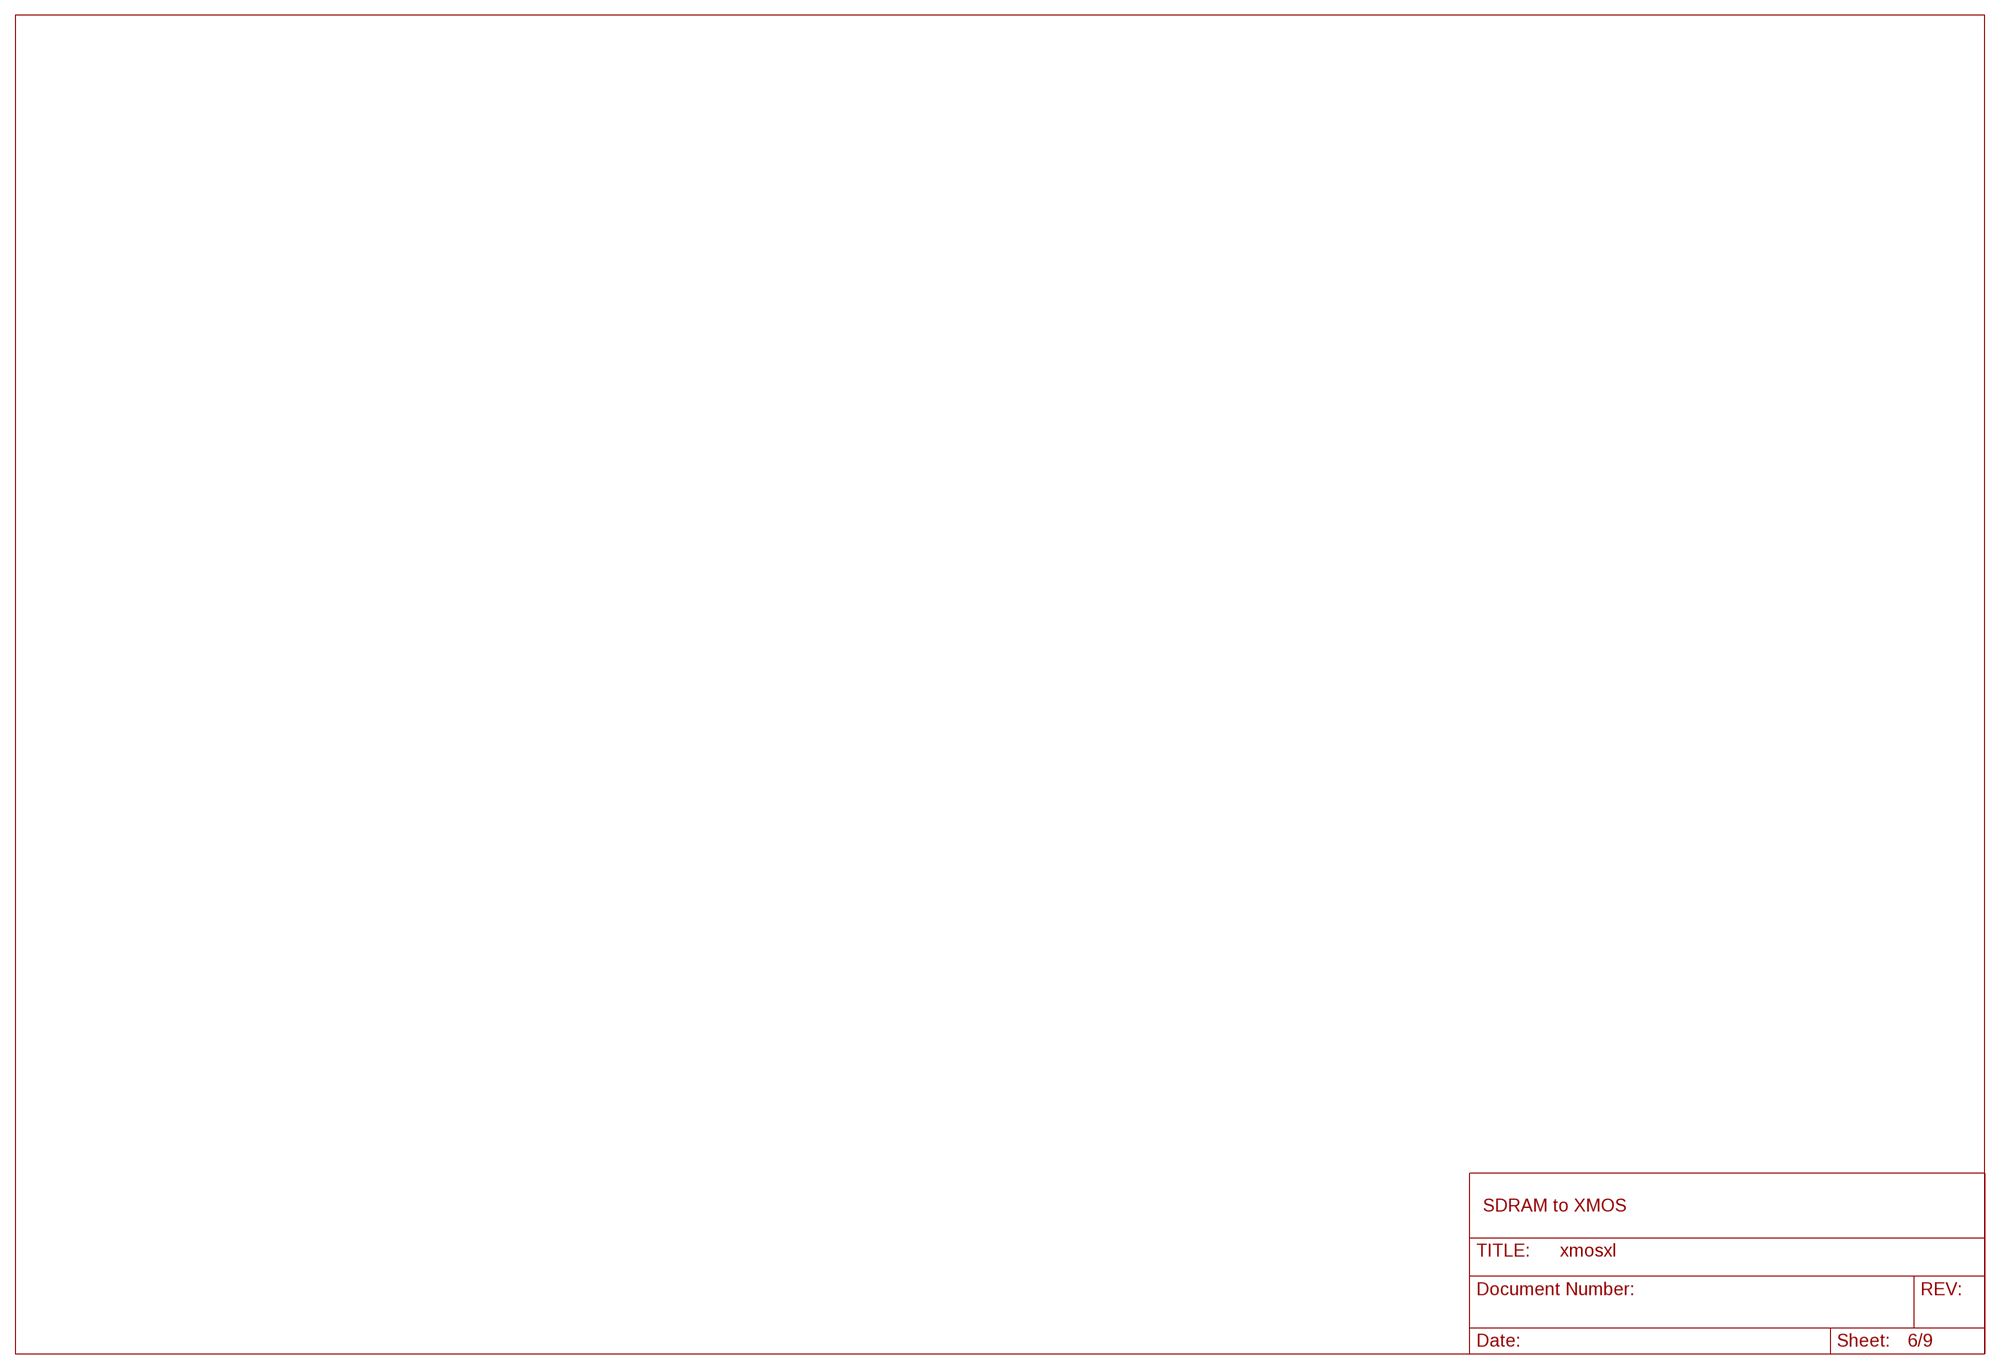
[diagram p6: schematic, sheet 6]

### Notes on the sheet
- SDRAM to XMOS

## Sheet 7 of 9: Raspberry PI interface
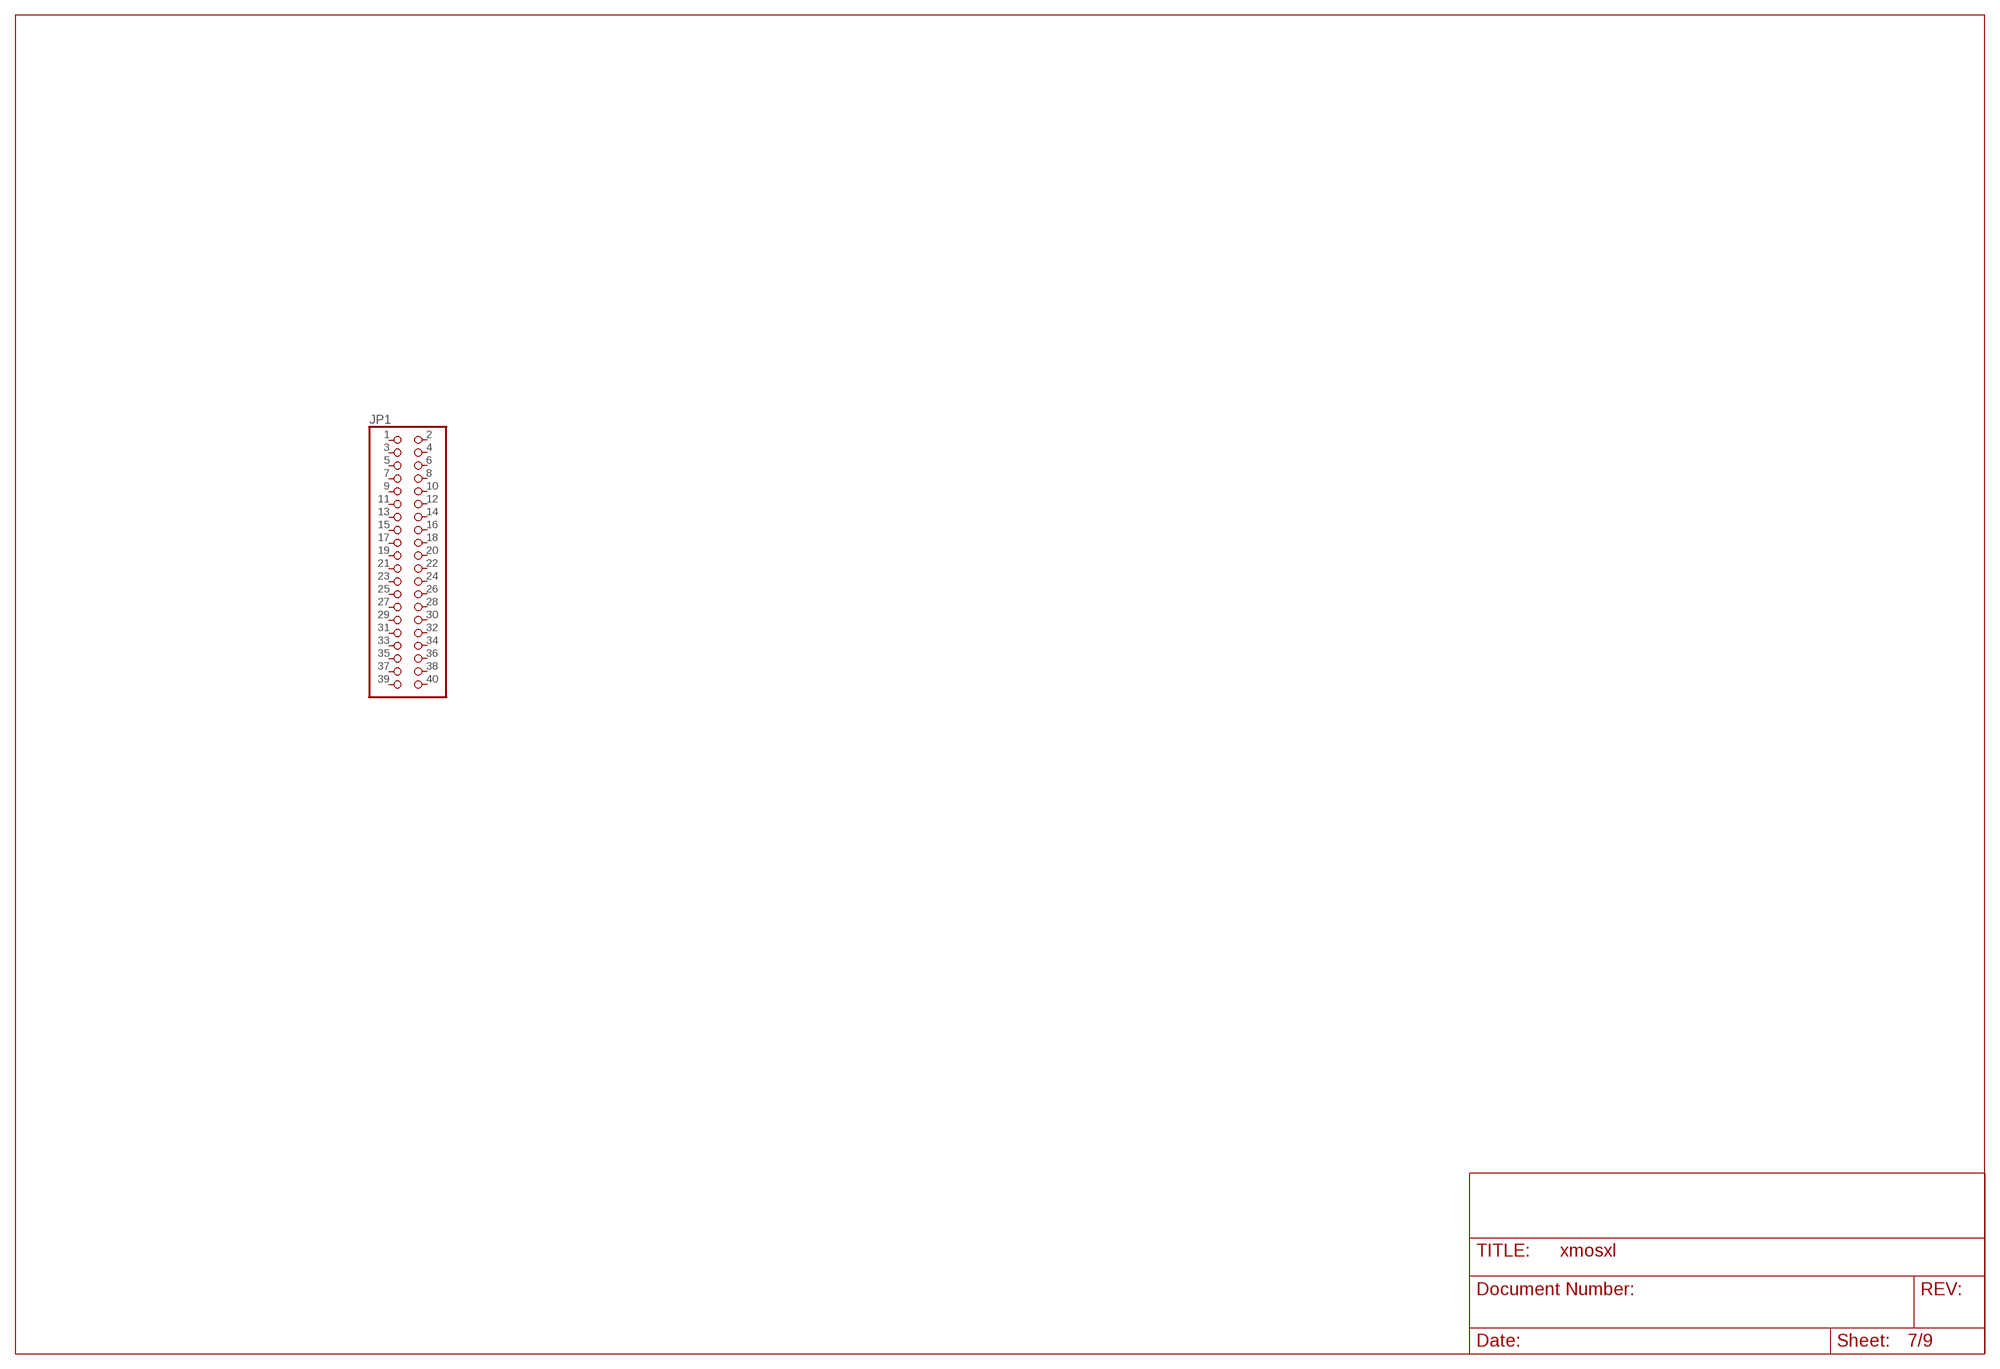
[diagram p7: schematic, sheet 7]

### Parts
JP1  PINHD-2X20  [2X20]
Unconnected: JP1.1 JP1.2 JP1.3 JP1.4 JP1.5 JP1.6 JP1.7 JP1.8 JP1.9 JP1.10 JP1.11 JP1.12 JP1.13 JP1.14 JP1.15 JP1.16 JP1.17 JP1.18 JP1.19 JP1.20 JP1.21 JP1.22 JP1.23 JP1.24 JP1.25 JP1.26 JP1.27 JP1.28 JP1.29 JP1.30 JP1.31 JP1.32 JP1.33 JP1.34 JP1.35 JP1.36 JP1.37 JP1.38 JP1.39 JP1.40

## Sheet 8 of 9: SLOTS 1,2,3
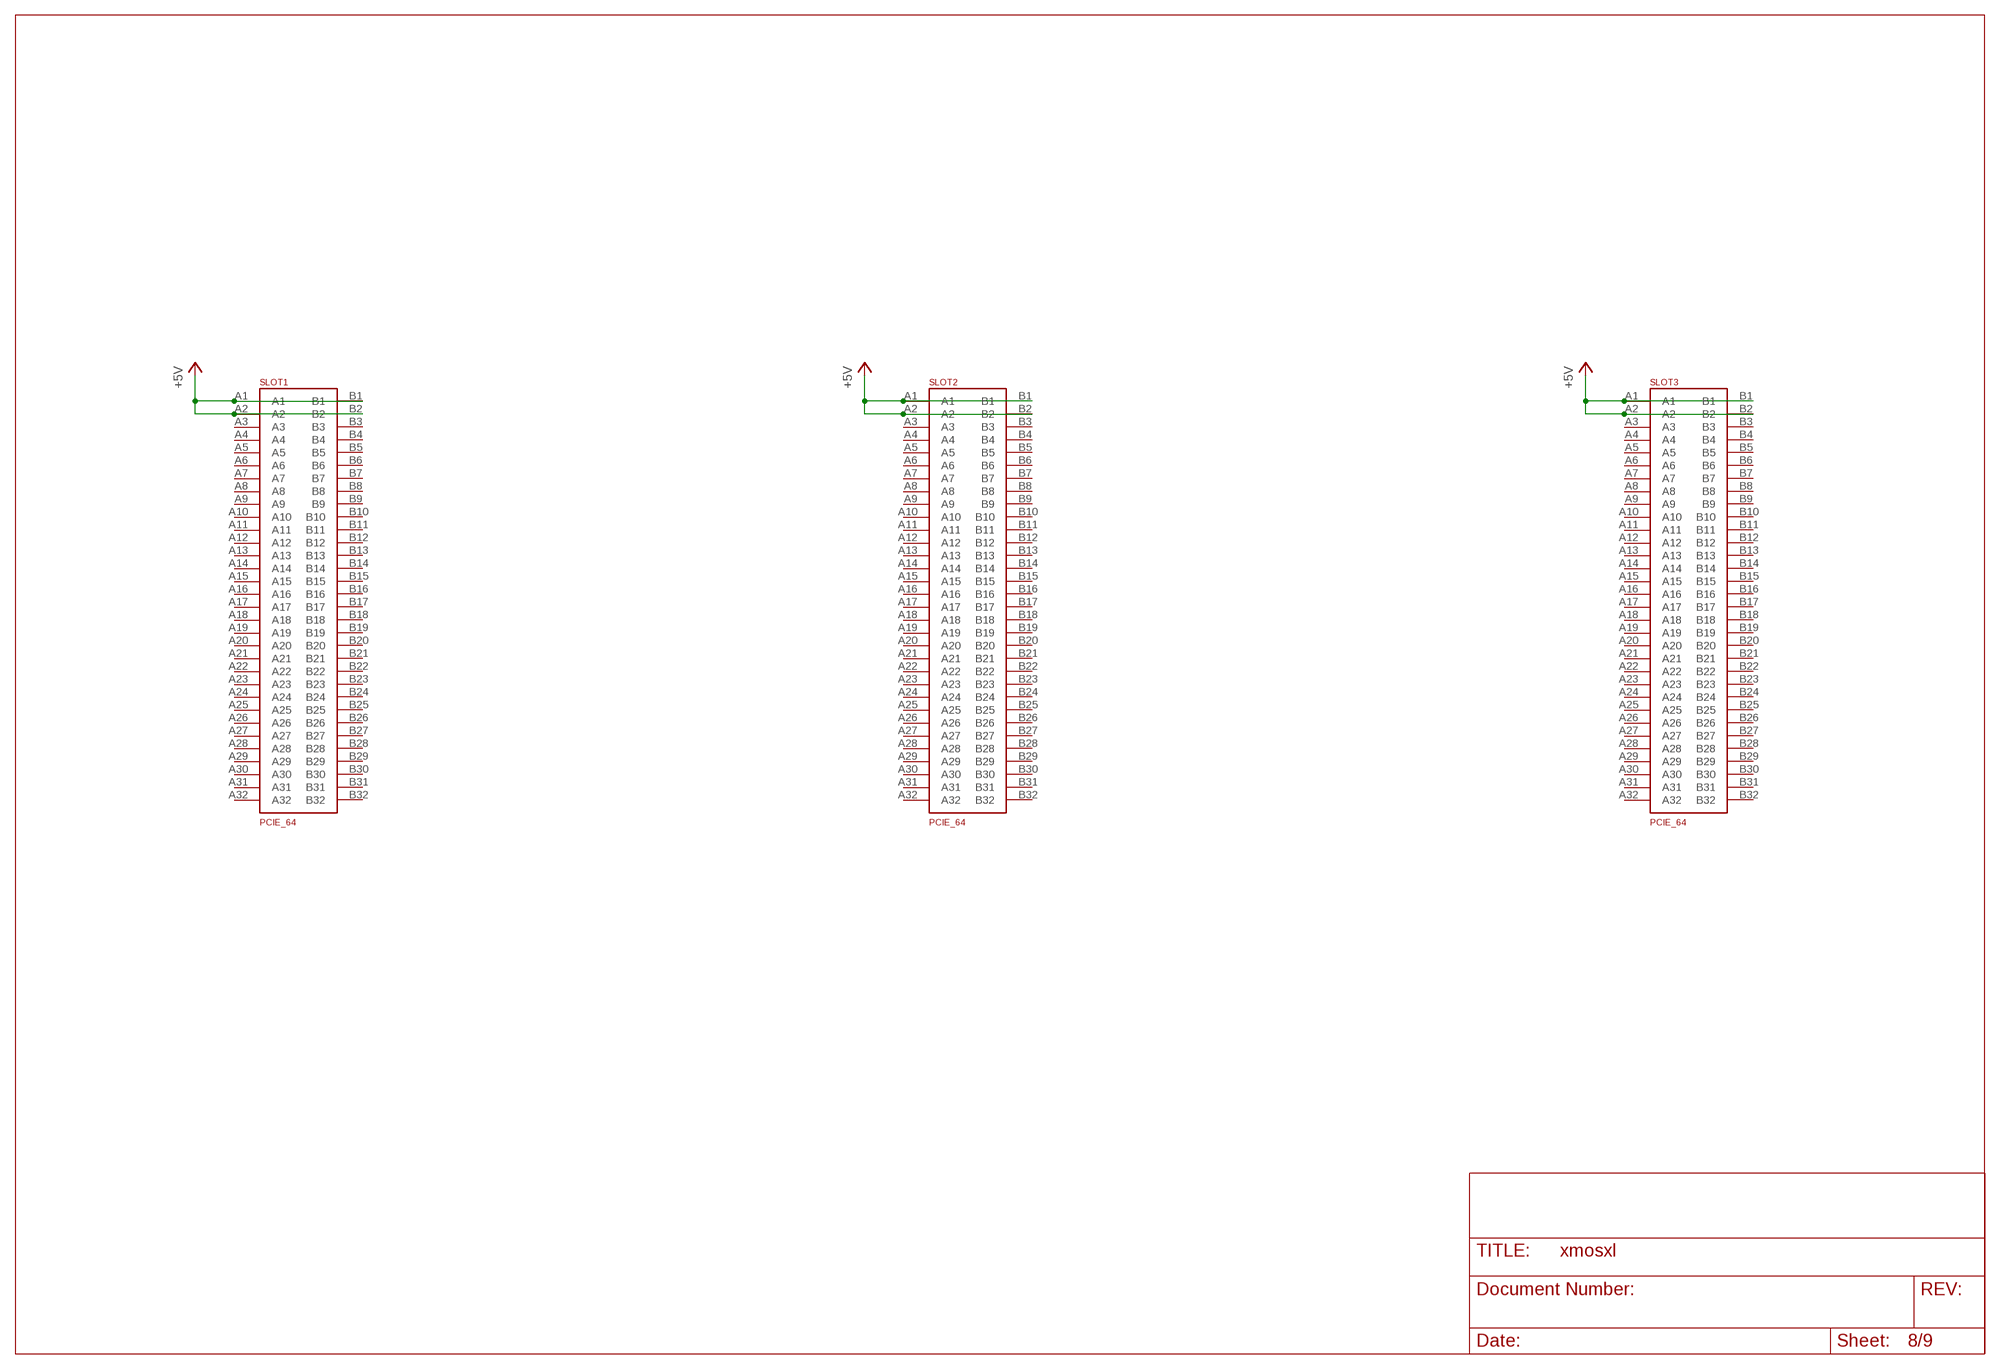
[diagram p8: schematic, sheet 8]

### Parts
SLOT1  PCIE_64  [PCI-E_64]
SLOT2  PCIE_64  [PCI-E_64]
SLOT3  PCIE_64  [PCI-E_64]

### Nets
+5V [5v power]: SLOT1.A1 SLOT1.A2 SLOT1.B1 SLOT1.B2 SLOT2.A1 SLOT2.A2 SLOT2.B1 SLOT2.B2 SLOT3.A1 SLOT3.A2 SLOT3.B1 SLOT3.B2 ; also sheet 2,3,9
Unconnected: SLOT1.A3 SLOT1.A4 SLOT1.A5 SLOT1.A6 SLOT1.A7 SLOT1.A8 SLOT1.A9 SLOT1.A10 SLOT1.A11 SLOT1.A12 SLOT1.A13 SLOT1.A14 SLOT1.A15 SLOT1.A16 SLOT1.A17 SLOT1.A18 SLOT1.A19 SLOT1.A20 SLOT1.A21 SLOT1.A22 SLOT1.A23 SLOT1.A24 SLOT1.A25 SLOT1.A26 SLOT1.A27 SLOT1.A28 SLOT1.A29 SLOT1.A30 SLOT1.A31 SLOT1.A32 SLOT1.B3 SLOT1.B4 SLOT1.B5 SLOT1.B6 SLOT1.B7 SLOT1.B8 SLOT1.B9 SLOT1.B10 SLOT1.B11 SLOT1.B12 SLOT1.B13 SLOT1.B14 SLOT1.B15 SLOT1.B16 SLOT1.B17 SLOT1.B18 SLOT1.B19 SLOT1.B20 SLOT1.B21 SLOT1.B22 SLOT1.B23 SLOT1.B24 SLOT1.B25 SLOT1.B26 SLOT1.B27 SLOT1.B28 SLOT1.B29 SLOT1.B30 SLOT1.B31 SLOT1.B32 SLOT2.A3 SLOT2.A4 SLOT2.A5 SLOT2.A6 SLOT2.A7 SLOT2.A8 SLOT2.A9 SLOT2.A10 SLOT2.A11 SLOT2.A12 SLOT2.A13 SLOT2.A14 SLOT2.A15 SLOT2.A16 SLOT2.A17 SLOT2.A18 SLOT2.A19 SLOT2.A20 SLOT2.A21 SLOT2.A22 SLOT2.A23 SLOT2.A24 SLOT2.A25 SLOT2.A26 SLOT2.A27 SLOT2.A28 SLOT2.A29 SLOT2.A30 SLOT2.A31 SLOT2.A32 SLOT2.B3 SLOT2.B4 SLOT2.B5 SLOT2.B6 SLOT2.B7 SLOT2.B8 SLOT2.B9 SLOT2.B10 SLOT2.B11 SLOT2.B12 SLOT2.B13 SLOT2.B14 SLOT2.B15 SLOT2.B16 SLOT2.B17 SLOT2.B18 SLOT2.B19 SLOT2.B20 SLOT2.B21 SLOT2.B22 SLOT2.B23 SLOT2.B24 SLOT2.B25 SLOT2.B26 SLOT2.B27 SLOT2.B28 SLOT2.B29 SLOT2.B30 SLOT2.B31 SLOT2.B32 SLOT3.A3 SLOT3.A4 SLOT3.A5 SLOT3.A6 SLOT3.A7 SLOT3.A8 SLOT3.A9 SLOT3.A10 SLOT3.A11 SLOT3.A12 SLOT3.A13 SLOT3.A14 SLOT3.A15 SLOT3.A16 SLOT3.A17 SLOT3.A18 SLOT3.A19 SLOT3.A20 SLOT3.A21 SLOT3.A22 SLOT3.A23 SLOT3.A24 SLOT3.A25 SLOT3.A26 SLOT3.A27 SLOT3.A28 SLOT3.A29 SLOT3.A30 SLOT3.A31 SLOT3.A32 SLOT3.B3 SLOT3.B4 SLOT3.B5 SLOT3.B6 SLOT3.B7 SLOT3.B8 SLOT3.B9 SLOT3.B10 SLOT3.B11 SLOT3.B12 SLOT3.B13 SLOT3.B14 SLOT3.B15 SLOT3.B16 SLOT3.B17 SLOT3.B18 SLOT3.B19 SLOT3.B20 SLOT3.B21 SLOT3.B22 SLOT3.B23 SLOT3.B24 SLOT3.B25 SLOT3.B26 SLOT3.B27 SLOT3.B28 SLOT3.B29 SLOT3.B30 SLOT3.B31 SLOT3.B32

## Sheet 9 of 9: SLOTS 4,5,6
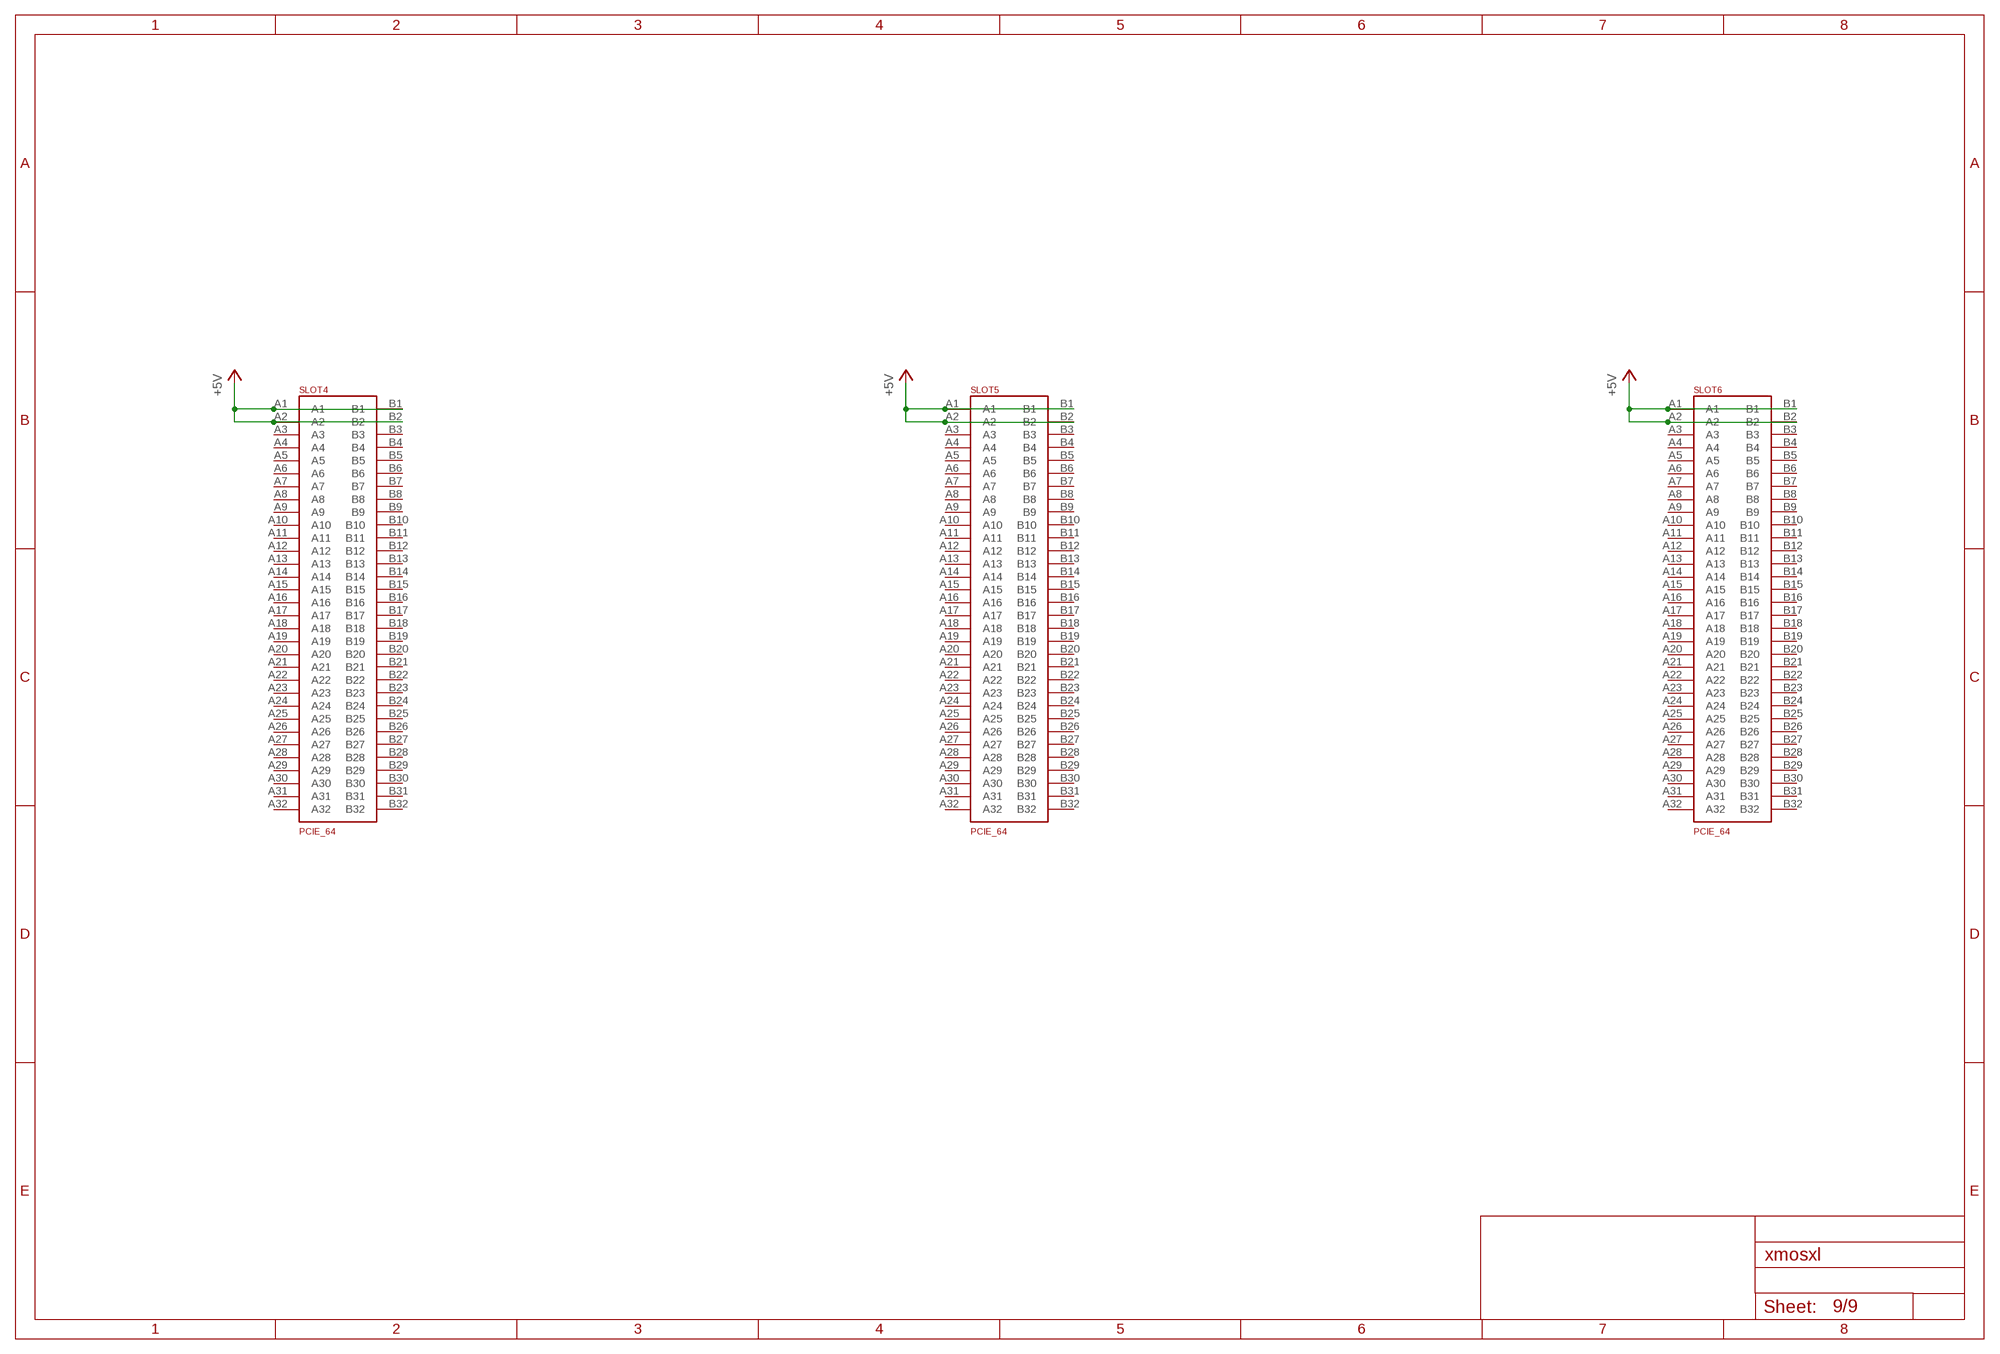
[diagram p9: schematic, sheet 9]

### Parts
SLOT4  PCIE_64  [PCI-E_64]
SLOT5  PCIE_64  [PCI-E_64]
SLOT6  PCIE_64  [PCI-E_64]

### Nets
+5V [5v power]: SLOT4.A1 SLOT4.A2 SLOT4.B1 SLOT4.B2 SLOT5.A1 SLOT5.A2 SLOT5.B1 SLOT5.B2 SLOT6.A1 SLOT6.A2 SLOT6.B1 SLOT6.B2 ; also sheet 2,3,8
Unconnected: SLOT4.A3 SLOT4.A4 SLOT4.A5 SLOT4.A6 SLOT4.A7 SLOT4.A8 SLOT4.A9 SLOT4.A10 SLOT4.A11 SLOT4.A12 SLOT4.A13 SLOT4.A14 SLOT4.A15 SLOT4.A16 SLOT4.A17 SLOT4.A18 SLOT4.A19 SLOT4.A20 SLOT4.A21 SLOT4.A22 SLOT4.A23 SLOT4.A24 SLOT4.A25 SLOT4.A26 SLOT4.A27 SLOT4.A28 SLOT4.A29 SLOT4.A30 SLOT4.A31 SLOT4.A32 SLOT4.B3 SLOT4.B4 SLOT4.B5 SLOT4.B6 SLOT4.B7 SLOT4.B8 SLOT4.B9 SLOT4.B10 SLOT4.B11 SLOT4.B12 SLOT4.B13 SLOT4.B14 SLOT4.B15 SLOT4.B16 SLOT4.B17 SLOT4.B18 SLOT4.B19 SLOT4.B20 SLOT4.B21 SLOT4.B22 SLOT4.B23 SLOT4.B24 SLOT4.B25 SLOT4.B26 SLOT4.B27 SLOT4.B28 SLOT4.B29 SLOT4.B30 SLOT4.B31 SLOT4.B32 SLOT5.A3 SLOT5.A4 SLOT5.A5 SLOT5.A6 SLOT5.A7 SLOT5.A8 SLOT5.A9 SLOT5.A10 SLOT5.A11 SLOT5.A12 SLOT5.A13 SLOT5.A14 SLOT5.A15 SLOT5.A16 SLOT5.A17 SLOT5.A18 SLOT5.A19 SLOT5.A20 SLOT5.A21 SLOT5.A22 SLOT5.A23 SLOT5.A24 SLOT5.A25 SLOT5.A26 SLOT5.A27 SLOT5.A28 SLOT5.A29 SLOT5.A30 SLOT5.A31 SLOT5.A32 SLOT5.B3 SLOT5.B4 SLOT5.B5 SLOT5.B6 SLOT5.B7 SLOT5.B8 SLOT5.B9 SLOT5.B10 SLOT5.B11 SLOT5.B12 SLOT5.B13 SLOT5.B14 SLOT5.B15 SLOT5.B16 SLOT5.B17 SLOT5.B18 SLOT5.B19 SLOT5.B20 SLOT5.B21 SLOT5.B22 SLOT5.B23 SLOT5.B24 SLOT5.B25 SLOT5.B26 SLOT5.B27 SLOT5.B28 SLOT5.B29 SLOT5.B30 SLOT5.B31 SLOT5.B32 SLOT6.A3 SLOT6.A4 SLOT6.A5 SLOT6.A6 SLOT6.A7 SLOT6.A8 SLOT6.A9 SLOT6.A10 SLOT6.A11 SLOT6.A12 SLOT6.A13 SLOT6.A14 SLOT6.A15 SLOT6.A16 SLOT6.A17 SLOT6.A18 SLOT6.A19 SLOT6.A20 SLOT6.A21 SLOT6.A22 SLOT6.A23 SLOT6.A24 SLOT6.A25 SLOT6.A26 SLOT6.A27 SLOT6.A28 SLOT6.A29 SLOT6.A30 SLOT6.A31 SLOT6.A32 SLOT6.B3 SLOT6.B4 SLOT6.B5 SLOT6.B6 SLOT6.B7 SLOT6.B8 SLOT6.B9 SLOT6.B10 SLOT6.B11 SLOT6.B12 SLOT6.B13 SLOT6.B14 SLOT6.B15 SLOT6.B16 SLOT6.B17 SLOT6.B18 SLOT6.B19 SLOT6.B20 SLOT6.B21 SLOT6.B22 SLOT6.B23 SLOT6.B24 SLOT6.B25 SLOT6.B26 SLOT6.B27 SLOT6.B28 SLOT6.B29 SLOT6.B30 SLOT6.B31 SLOT6.B32

## Power pins joined to a net without a drawn wire
VBAT: U$1.6(-POWER:VBAT)
VCAP: U$1.92(-POWER:VCAP) U$1.148(-POWER:VCAP)
VDD: U$1.15(-POWER:VDD) U$1.26(-POWER:VDD) U$1.39(-POWER:VDD) U$1.52(-POWER:VDD) U$1.59(-POWER:VDD) U$1.73(-POWER:VDD) U$1.83(-POWER:VDD) U$1.94(-POWER:VDD) U$1.103(-POWER:VDD) U$1.115(-POWER:VDD) U$1.124(-POWER:VDD) U$1.150(-POWER:VDD) U$1.158(-POWER:VDD) U$1.185(-POWER:VDD) U$1.204(-POWER:VDD)
VDDA: U$1.42(-POWER:VDDA)
VDDSDMMC: U$1.171(-POWER:VDDSDMMC)
VDDUSB: U$1.137(-POWER:VDDUSB)
VREF+: U$1.41(-POWER:VREF+)
VSS: U$1.14(-POWER:VSS) U$1.25(-POWER:VSS) U$1.51(-POWER:VSS) U$1.60(-POWER:VSS) U$1.72(-POWER:VSS) U$1.82(-POWER:VSS) U$1.93(-POWER:VSS) U$1.114(-POWER:VSS) U$1.125(-POWER:VSS) U$1.136(-POWER:VSS) U$1.149(-POWER:VSS) U$1.170(-POWER:VSS) U$1.184(-POWER:VSS) U$1.202(-POWER:VSS)
VSSA: U$1.40(-POWER:VSSA)

## Library data of the parts
A8_CONN = sjg-con:MINI-SAS: Mini-SAS connector, right angle through hole Part 1888019-4 Digikey part A111092CT-ND; USE: 75783-0140
AUDIO = pinhead:PINHD-1X3: PIN HEADER
C1 C2 C44 C45 = rcl:C-EU: CAPACITOR, European symbol; SPICEPREFIX: C
C3 C5 C6 C12 C13 C15-C20 C51 C52 = rcl:C-EU: CAPACITOR, European symbol; SPICEPREFIX: C; USE: GRM033C80J104ME15D
C53 = rcl:C-EU: CAPACITOR, European symbol
DBG0 DBG1-DBG3 = led:LED: LED OSRAM: - CHIPLED LG R971, LG N971, LY N971, LG Q971, LY Q971, LO R971, LY R971 LH N974, LH R974 LS Q976, LO Q976, LY Q976 LO Q996 - Hyper CHIPLED LW Q18S LB Q993, LB Q99A, LB R99A - SideLED LS A670, LO A670, LY A670, LG A670, LP A670 LB A673, LV A673, LT A673, LW A673 LH A674 LY A675 LS A676, LA A676, LO A676, LY A676, LW A676 LS A679, LY A679, LG A679 - Hyper Micro SIDELED® LS Y876, LA Y876, LO Y876, LY Y876 LT Y87S - SmartLED LW L88C, LW L88S LB L89C, LB L89S, LG L890 LS L89K, LO L89K, LY L89K LS L896, LA L896, LO L896, LY L896 - TOPLED LS T670, LO T670, LY T670, LG T670, LP T670 LSG T670, LSP T670, LSY T670, LOP T670, LYG T670 LG T671, LOG T671, LSG T671 LB T673, LV T673, LT T673, LW T673 LH T674 LS T676, LA T676, LO T676, LY T676, LB T676, LH T676, LSB T676, LW T676 LB T67C, LV T67C, LT T67C, LS T67K, LO T67K, LY T67K, LW E67C LS E67B, LA E67B, LO E67B, LY E67B, LB E67C, LV E67C, LT E67C LW T67C LS T679, LY T679, LG T679 LS T770, LO T770, LY T770, LG T770, LP T770 LB T773, LV T773, LT T773, LW T773 LH T774 LS E675, LA E675, LY E675, LS T675 LS T776, LA T776, LO T776, LY T776, LB T776 LHGB T686 LT T68C, LB T68C - Hyper Mini TOPLED® LB M676 - Mini TOPLED Santana® LG M470 LS M47K, LO M47K, LY M47K Source: http://www.osram.convergy.de LUXEON: - LUMILED® LXK2-PW12-R00, LXK2-PW12-S00, LXK2-PW14-U00, LXK2-PW14-V00 LXK2-PM12-R00, LXK2-PM12-S00, LXK2-PM14-U00 LXK2-PE12-Q00, LXK2-PE12-R00, LXK2-PE12-S00, LXK2-PE14-T00, LXK2-PE14-U00 LXK2-PB12-K00, LXK2-PB12-L00, LXK2-PB12-M00, LXK2-PB14-N00, LXK2-PB14-P00, LXK2-PB14-Q00 LXK2-PR12-L00, LXK2-PR12-M00, LXK2-PR14-Q00, LXK2-PR14-R00 LXK2-PD12-Q00, LXK2-PD12-R00, LXK2-PD12-S00 LXK2-PH12-R00, LXK2-PH12-S00 LXK2-PL12-P00, LXK2-PL12-Q00, LXK2-PL12-R00 Source: www.luxeon.com KINGBRIGHT: KA-3528ASYC Source: www.kingbright.com
H1-H4 = holes:MOUNT-HOLE: MOUNTING HOLE with drill center marker
IC1 = samacsys:MCP1727-1802E_SN: LDO Regulator 1.5A 1.2V PG SOIC8 Source: Datasheet <http://docs-emea.rs-online.com/webdocs/131f/0900766b8131f8d7.pdf>; ARROW_PART_NUMBER: MCP1727-1802E/SN; ARROW_PRICE-STOCK: https://www.arrow.com/en/products/mcp1727-1802esn/microchip-technology; DESCRIPTION: LDO Regulator 1.5A 1.2V PG SOIC8; HEIGHT: 1.75mm; MANUFACTURER_NAME: Microchip; MANUFACTURER_PART_NUMBER: MCP1727-1802E/SN; MOUSER_PART_NUMBER: 579-MCP1727-1802E/SN; MOUSER_PRICE-STOCK: https://www.mouser.com/Search/Refine.aspx?Keyword=579-MCP1727-1802E%2FSN
IC2 = samacsys:ICE40HX4K-TQ144: FPGA - Field Programmable Gate Array Source: Datasheet <https://componentsearchengine.com/Datasheets/1/iCE40HX4K-TQ144.pdf>; ARROW_PART_NUMBER: ICE40HX4K-TQ144; ARROW_PRICE-STOCK: https://www.arrow.com/en/products/ice40hx4k-tq144/lattice-semiconductor; DESCRIPTION: FPGA - Field Programmable Gate Array; HEIGHT: 1.6mm; MANUFACTURER_NAME: Lattice Semiconductor; MANUFACTURER_PART_NUMBER: iCE40HX4K-TQ144; MOUSER_PART_NUMBER: 842-ICE40HX4K-TQ144; MOUSER_PRICE-STOCK: https://www.mouser.co.uk/ProductDetail/Lattice/iCE40HX4K-TQ144?qs=F9A14TELRMvGNTZXkNDuOw%3D%3D
IC3 = samacsys:MT48LC32M8A2P-6AG: DRAM Chip SDRAM 256Mbit 32Mx8 3.3V 54-Pin TSOP-II Source: Datasheet <https://www.micron.com/~/media/documents/products/data-sheet/dram/256mb_sdr.pdf>; ARROW_PART_NUMBER: MT48LC32M8A2P-6AG; ARROW_PRICE-STOCK: https://www.arrow.com/en/products/mt48lc32m8a2p-6ag/micron-technology; DESCRIPTION: DRAM Chip SDRAM 256Mbit 32Mx8 3.3V 54-Pin TSOP-II; HEIGHT: 1.2mm; MANUFACTURER_NAME: Micron; MANUFACTURER_PART_NUMBER: MT48LC32M8A2P-6AG
IC6 IC7 = samacsys:74ALVC164245DGG_11: 74ALVC164245 - 16-bit dual supply translating transceiver; 3-state@en-us Source: Datasheet <https://assets.nexperia.com/documents/data-sheet/74ALVC164245.pdf>; ARROW_PART_NUMBER: 74ALVC164245DGG:11; ARROW_PRICE-STOCK: https://www.arrow.com/en/products/74alvc164245dgg11/nexperia; DESCRIPTION: 74ALVC164245 - 16-bit dual supply translating transceiver; 3-state@en-us; HEIGHT: 1.2mm; MANUFACTURER_NAME: Nexperia; MANUFACTURER_PART_NUMBER: 74ALVC164245DGG:11; MOUSER_PART_NUMBER: 771-74ALVC164245; MOUSER_PRICE-STOCK: https://www.mouser.co.uk/ProductDetail/Nexperia/74ALVC164245DGG11?qs=odJ8N4Y39o4j0ykFPcnqaQ%3D%3D
IC8 IC9 = samacsys:74LVC1T45W6-7: Translation - Voltage Levels Logic LVC 1G Translator Source: Datasheet <https://www.diodes.com/assets/Datasheets/74LVC1T45.pdf>; ARROW_PART_NUMBER: 74LVC1T45W6-7; ARROW_PRICE-STOCK: https://www.arrow.com/en/products/74lvc1t45w6-7/diodes-incorporated; DESCRIPTION: Translation - Voltage Levels Logic LVC 1G Translator; HEIGHT: 1.4mm; MANUFACTURER_NAME: Diodes Inc.; MANUFACTURER_PART_NUMBER: 74LVC1T45W6-7; MOUSER_PART_NUMBER: 621-74LVC1T45W6-7; MOUSER_PRICE-STOCK: https://www.mouser.co.uk/ProductDetail/Diodes-Incorporated/74LVC1T45W6-7?qs=Oxncjon6mbp2oDYwZRj9AA%3D%3D
JP1 = pinhead:PINHD-2X20: PIN HEADER
PJ-102AH = adafruit:2.1MMJACK: 2.1mm x 5.5mm THM DC jack with internal switch. Digikey part #PJ-102A, 4UCON part #05537 2.1mm x 5.5mm SMT DC jack with internal switch. Digikey part #PJ-002A-SMT, 4UCON part #03267 By microbuilder.eu & adafruit.com
R4 R8 R11 = rcl:R-EU_: RESISTOR, European symbol; SPICEPREFIX: R
R20 R21 R55 R56 = rcl:R-EU_: RESISTOR, European symbol
SLOT1-SLOT6 = pcie:PCIE_64; USE: 10018784-10201TLF
U1 = SparkFun:OSCILLATOR
U$1 = xmosxl:STM32F767: STM32 for xmosxl
U$2 = sjg-power:AP7363: AP7363 voltage regulator, in +5v, out +1.0v @ 1.5A http://www.digikey.com/product-detail/en/AP7363-10D-13/AP7363-10D-13CT-ND/3829398

## Net classes
1 3v power: width 0.305 mm
2 5v power: width 0.305 mm

## Board
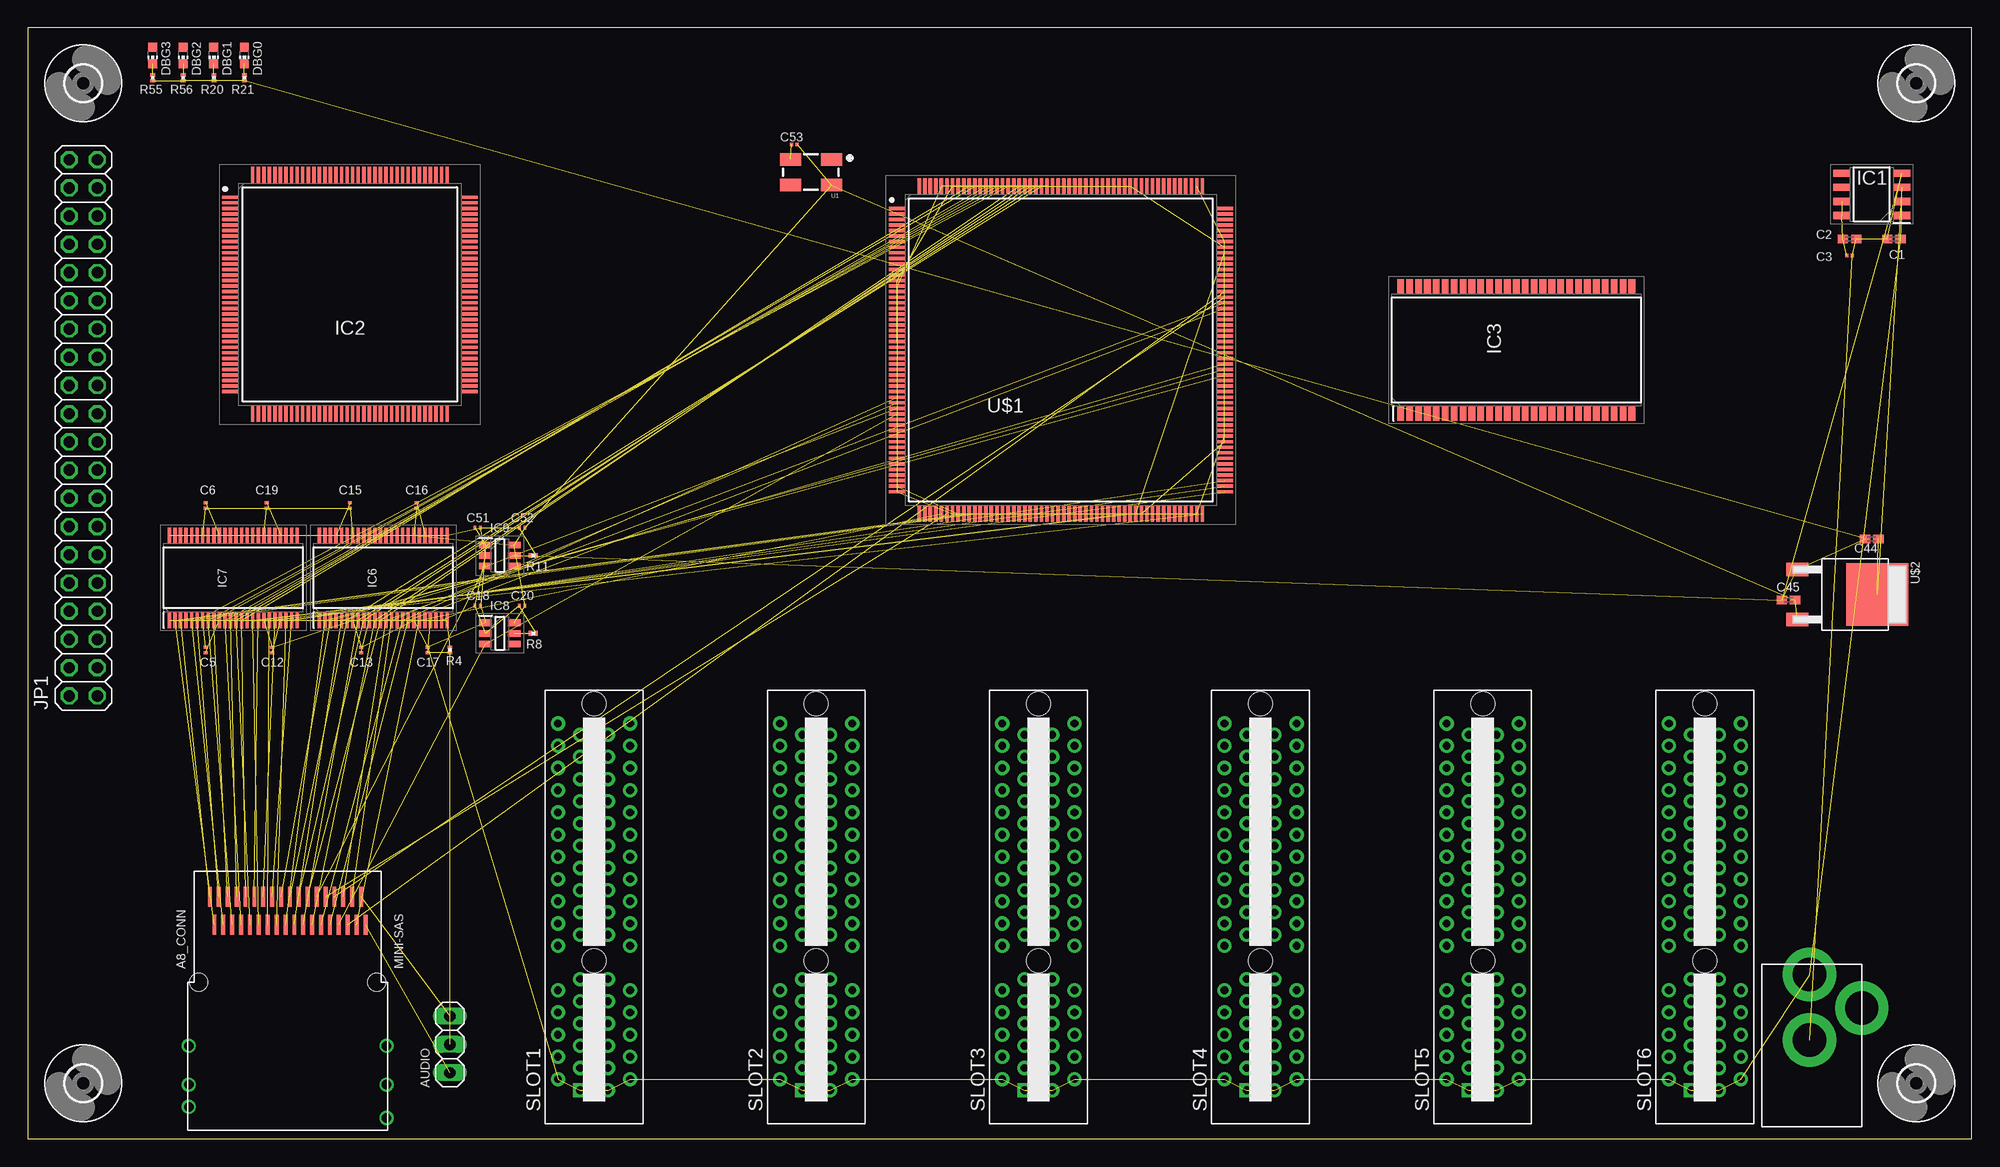
[diagram p10: board, top side]
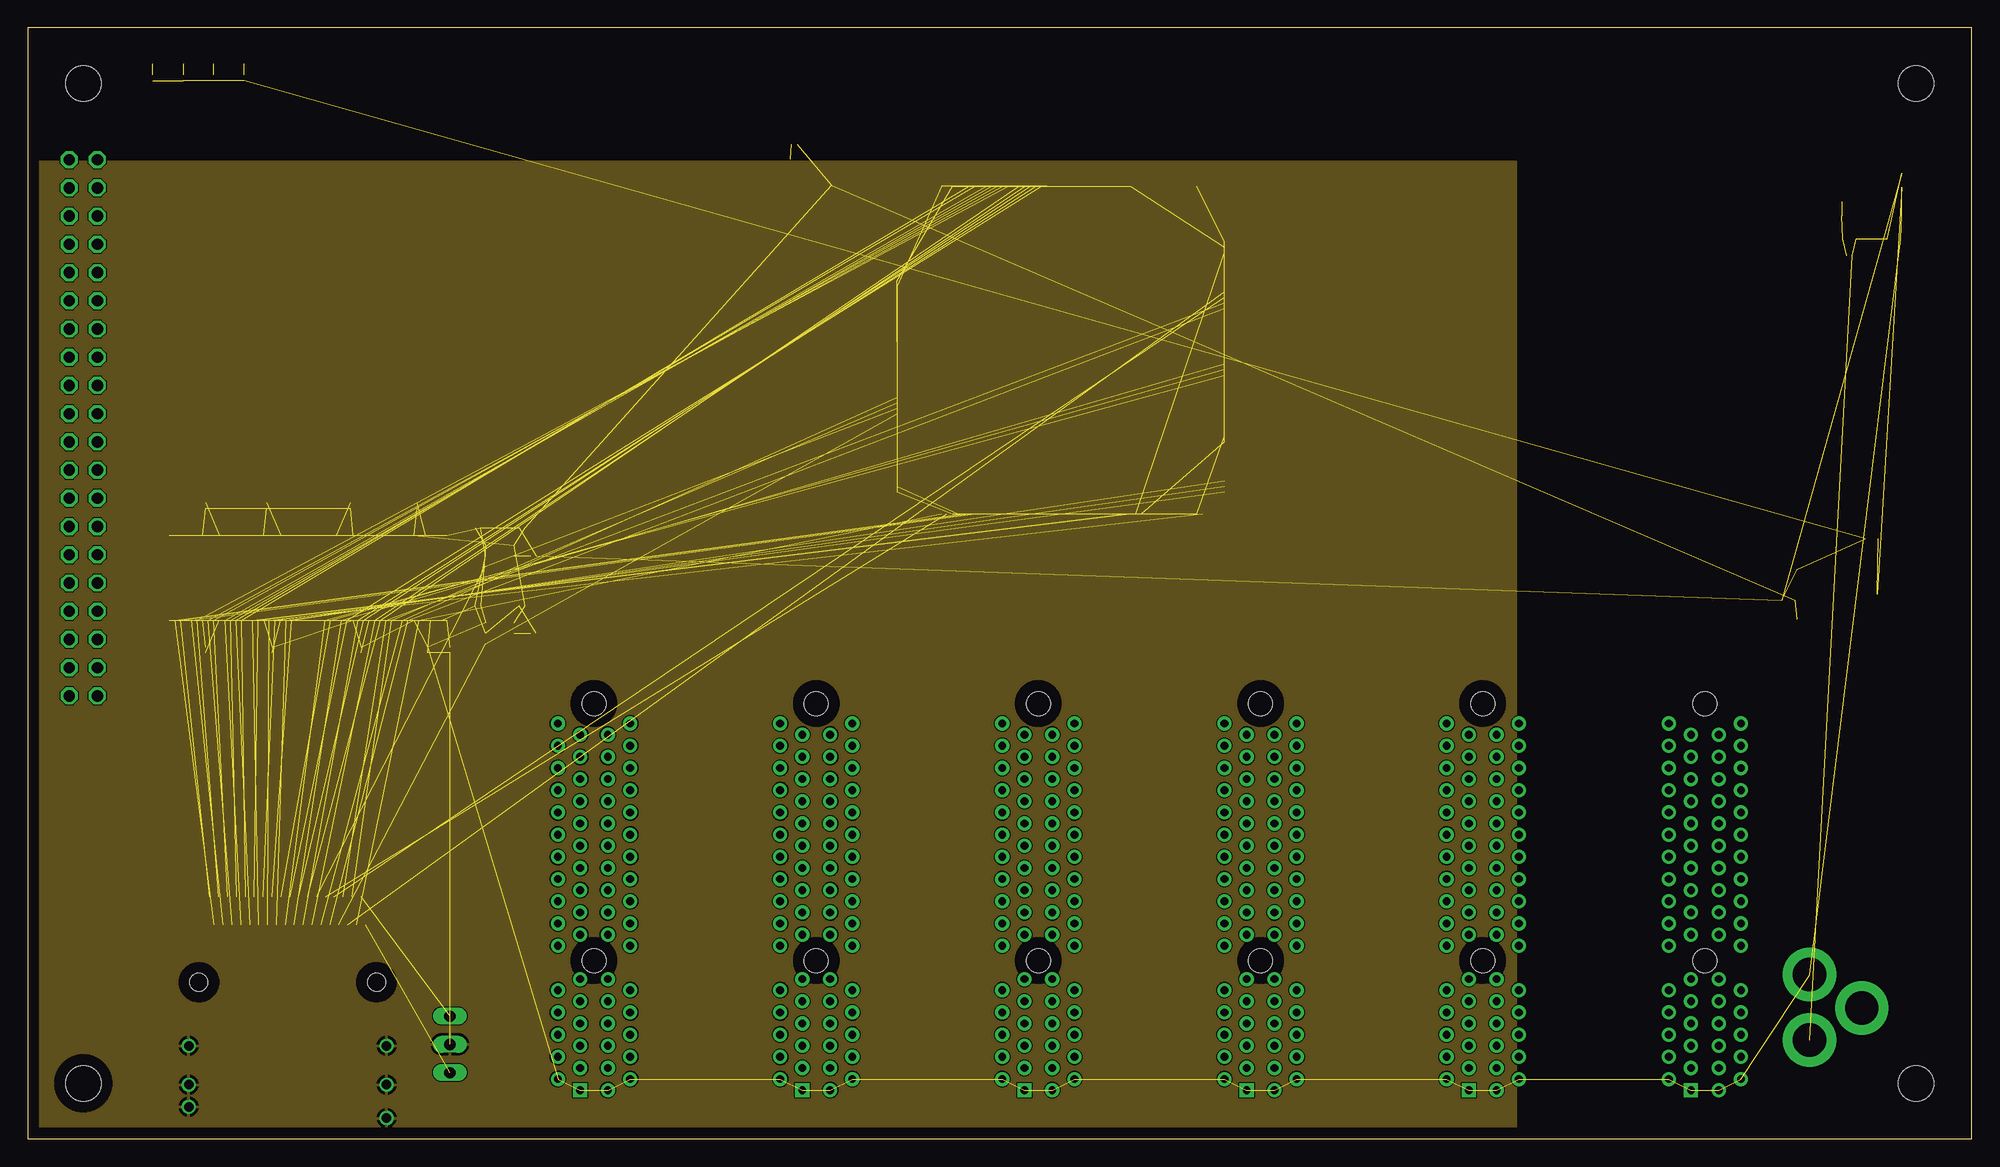
[diagram p11: board, inner layer Route2]

Size 175 x 100 mm. Coordinates in mm from the lower left corner, seen from the top.
Outline: 0,0 175,0 175,100 0,100 0,0
Copper layers (1+2*3+14*15+16): Top 0.035mm / dielectric 0.11mm / Route2 0.035mm / dielectric 0.53mm / Route3 0.035mm / dielectric 0.11mm / Route14 0.035mm / dielectric 0.53mm / Route15 0.035mm / dielectric 0.12mm / Bottom 0.035mm
Design rules "default *": minimum track width 4mil, minimum drill 0.2mm, track to track 4mil, track to pad 4mil, pad to pad 4mil, via to via 4mil, smd to smd 4mil, copper to edge 40mil, drill to drill 4mil, minimum pad ring 5mil, minimum via ring 5mil, stop-mask expansion 4mil, vias tented up to drill 0mil, thermal gap 10mil

### Footprints (pad centres in the part's own frame; a part is rotated, then mirrored left to right if it is on the bottom)
MINI-SAS = smd 0.35 x 1.8: PA1 -6.2,8.78; PA2 -5.4,8.78; PA3 -4.6,8.78; PA4 -3.8,8.78; PA5 -3,8.78; PA6 -2.2,8.78; PA7 -1.4,8.78; PA8 -0.6,8.78; PA9 0.2,8.78; PA10 1,8.78; PA11 1.8,8.78; PA12 2.6,8.78; PA13 3.4,8.78; PA14 4.2,8.78; PA15 5,8.78; PA16 5.8,8.78; PA17 6.6,8.78; PA18 7.4,8.78; PB1 -6.6,11.29; PB2 -5.8,11.29; PB3 -5,11.29; PB4 -4.2,11.29; PB5 -3.4,11.29; PB6 -2.6,11.29; PB7 -1.8,11.29; PB8 -1,11.29; PB9 -0.2,11.29; PB10 0.6,11.29; PB11 1.4,11.29; PB12 2.2,11.29; PB13 3,11.29; PB14 3.8,11.29; PB15 4.6,11.29; PB16 5.4,11.29; PB17 6.2,11.29; PB18 7,11.29 | drill 0.85: SHIELD1 -8.5,-2.12; SHIELD2 -8.5,-5.62; SHIELD3 -8.5,-7.62; SHIELD4 9.3,-2.12; SHIELD5 9.3,-5.62; SHIELD6 9.3,-8.62 | hole 1.6: -7.6,3.6; 8.4,3.6
1X03 = drill 1.016 long: 1 -2.54,0; 2 0,0; 3 2.54,0
C0402K = smd 0.925 x 0.74: 1 -0.6,0; 2 0.6,0
C0201 = smd 0.25 x 0.35: 1 -0.25,0; 2 0.25,0
CHIP-LED0603 = smd 0.8 x 0.8: A 0,-0.75; C 0,0.75
3,2 = hole 3.2: 0,0
SOIC127P600X175-8N = smd 1.5 x 0.65: 1 -2.7,1.905; 2 -2.7,0.635; 3 -2.7,-0.635; 4 -2.7,-1.905; 5 2.7,-1.905; 6 2.7,-0.635; 7 2.7,0.635; 8 2.7,1.905
QFP50P2200X2200X160-144N = smd 1.475 x 0.3: 1 -10.738,8.75; 2 -10.738,8.25; 3 -10.738,7.75; 4 -10.738,7.25; 5 -10.738,6.75; 6 -10.738,6.25; 7 -10.738,5.75; 8 -10.738,5.25; 9 -10.738,4.75; 10 -10.738,4.25; 11 -10.738,3.75; 12 -10.738,3.25; 13 -10.738,2.75; 14 -10.738,2.25; 15 -10.738,1.75; 16 -10.738,1.25; 17 -10.738,0.75; 18 -10.738,0.25; 19 -10.738,-0.25; 20 -10.738,-0.75; 21 -10.738,-1.25; 22 -10.738,-1.75; 23 -10.738,-2.25; 24 -10.738,-2.75; 25 -10.738,-3.25; 26 -10.738,-3.75; 27 -10.738,-4.25; 28 -10.738,-4.75; 29 -10.738,-5.25; 30 -10.738,-5.75; 31 -10.738,-6.25; 32 -10.738,-6.75; 33 -10.738,-7.25; 34 -10.738,-7.75; 35 -10.738,-8.25; 36 -10.738,-8.75; 73 10.738,-8.75; 74 10.738,-8.25; 75 10.738,-7.75; 76 10.738,-7.25; 77 10.738,-6.75; 78 10.738,-6.25; 79 10.738,-5.75; 80 10.738,-5.25; 81 10.738,-4.75; 82 10.738,-4.25; 83 10.738,-3.75; 84 10.738,-3.25; 85 10.738,-2.75; 86 10.738,-2.25; 87 10.738,-1.75; 88 10.738,-1.25; 89 10.738,-0.75; 90 10.738,-0.25; 91 10.738,0.25; 92 10.738,0.75; 93 10.738,1.25; 94 10.738,1.75; 95 10.738,2.25; 96 10.738,2.75; 97 10.738,3.25; 98 10.738,3.75; 99 10.738,4.25; 100 10.738,4.75; 101 10.738,5.25; 102 10.738,5.75; 103 10.738,6.25; 104 10.738,6.75; 105 10.738,7.25; 106 10.738,7.75; 107 10.738,8.25; 108 10.738,8.75 | smd 0.3 x 1.475: 37 -8.75,-10.738; 38 -8.25,-10.738; 39 -7.75,-10.738; 40 -7.25,-10.738; 41 -6.75,-10.738; 42 -6.25,-10.738; 43 -5.75,-10.738; 44 -5.25,-10.738; 45 -4.75,-10.738; 46 -4.25,-10.738; 47 -3.75,-10.738; 48 -3.25,-10.738; 49 -2.75,-10.738; 50 -2.25,-10.738; 51 -1.75,-10.738; 52 -1.25,-10.738; 53 -0.75,-10.738; 54 -0.25,-10.738; 55 0.25,-10.738; 56 0.75,-10.738; 57 1.25,-10.738; 58 1.75,-10.738; 59 2.25,-10.738; 60 2.75,-10.738; 61 3.25,-10.738; 62 3.75,-10.738; 63 4.25,-10.738; 64 4.75,-10.738; 65 5.25,-10.738; 66 5.75,-10.738; 67 6.25,-10.738; 68 6.75,-10.738; 69 7.25,-10.738; 70 7.75,-10.738; 71 8.25,-10.738; 72 8.75,-10.738; 109 8.75,10.738; 110 8.25,10.738; 111 7.75,10.738; 112 7.25,10.738; 113 6.75,10.738; 114 6.25,10.738; 115 5.75,10.738; 116 5.25,10.738; 117 4.75,10.738; 118 4.25,10.738; 119 3.75,10.738; 120 3.25,10.738; 121 2.75,10.738; 122 2.25,10.738; 123 1.75,10.738; 124 1.25,10.738; 125 0.75,10.738; 126 0.25,10.738; 127 -0.25,10.738; 128 -0.75,10.738; 129 -1.25,10.738; 130 -1.75,10.738; 131 -2.25,10.738; 132 -2.75,10.738; 133 -3.25,10.738; 134 -3.75,10.738; 135 -4.25,10.738; 136 -4.75,10.738; 137 -5.25,10.738; 138 -5.75,10.738; 139 -6.25,10.738; 140 -6.75,10.738; 141 -7.25,10.738; 142 -7.75,10.738; 143 -8.25,10.738; 144 -8.75,10.738
SOP80P1176X120-54N = smd 1.295 x 0.6: 1 -5.728,10.4; 2 -5.728,9.6; 3 -5.728,8.8; 4 -5.728,8; 5 -5.728,7.2; 6 -5.728,6.4; 7 -5.728,5.6; 8 -5.728,4.8; 9 -5.728,4; 10 -5.728,3.2; 11 -5.728,2.4; 12 -5.728,1.6; 13 -5.728,0.8; 14 -5.728,0; 15 -5.728,-0.8; 16 -5.728,-1.6; 17 -5.728,-2.4; 18 -5.728,-3.2; 19 -5.728,-4; 20 -5.728,-4.8; 21 -5.728,-5.6; 22 -5.728,-6.4; 23 -5.728,-7.2; 24 -5.728,-8; 25 -5.728,-8.8; 26 -5.728,-9.6; 27 -5.728,-10.4; 28 5.728,-10.4; 29 5.728,-9.6; 30 5.728,-8.8; 31 5.728,-8; 32 5.728,-7.2; 33 5.728,-6.4; 34 5.728,-5.6; 35 5.728,-4.8; 36 5.728,-4; 37 5.728,-3.2; 38 5.728,-2.4; 39 5.728,-1.6; 40 5.728,-0.8; 41 5.728,0; 42 5.728,0.8; 43 5.728,1.6; 44 5.728,2.4; 45 5.728,3.2; 46 5.728,4; 47 5.728,4.8; 48 5.728,5.6; 49 5.728,6.4; 50 5.728,7.2; 51 5.728,8; 52 5.728,8.8; 53 5.728,9.6; 54 5.728,10.4
SOP50P810X120-48N = smd 1.425 x 0.3: 1 -3.812,5.75; 2 -3.812,5.25; 3 -3.812,4.75; 4 -3.812,4.25; 5 -3.812,3.75; 6 -3.812,3.25; 7 -3.812,2.75; 8 -3.812,2.25; 9 -3.812,1.75; 10 -3.812,1.25; 11 -3.812,0.75; 12 -3.812,0.25; 13 -3.812,-0.25; 14 -3.812,-0.75; 15 -3.812,-1.25; 16 -3.812,-1.75; 17 -3.812,-2.25; 18 -3.812,-2.75; 19 -3.812,-3.25; 20 -3.812,-3.75; 21 -3.812,-4.25; 22 -3.812,-4.75; 23 -3.812,-5.25; 24 -3.812,-5.75; 25 3.812,-5.75; 26 3.812,-5.25; 27 3.812,-4.75; 28 3.812,-4.25; 29 3.812,-3.75; 30 3.812,-3.25; 31 3.812,-2.75; 32 3.812,-2.25; 33 3.812,-1.75; 34 3.812,-1.25; 35 3.812,-0.75; 36 3.812,-0.25; 37 3.812,0.25; 38 3.812,0.75; 39 3.812,1.25; 40 3.812,1.75; 41 3.812,2.25; 42 3.812,2.75; 43 3.812,3.25; 44 3.812,3.75; 45 3.812,4.25; 46 3.812,4.75; 47 3.812,5.25; 48 3.812,5.75
SOT95P285X140-6N = smd 1.15 x 0.6: 1 -1.3,0.95; 2 -1.3,0; 3 -1.3,-0.95; 4 1.3,-0.95; 5 1.3,0; 6 1.3,0.95
2X20 = drill 1.016 octagon: 1 -24.13,-1.27; 2 -24.13,1.27; 3 -21.59,-1.27; 4 -21.59,1.27; 5 -19.05,-1.27; 6 -19.05,1.27; 7 -16.51,-1.27; 8 -16.51,1.27; 9 -13.97,-1.27; 10 -13.97,1.27; 11 -11.43,-1.27; 12 -11.43,1.27; 13 -8.89,-1.27; 14 -8.89,1.27; 15 -6.35,-1.27; 16 -6.35,1.27; 17 -3.81,-1.27; 18 -3.81,1.27; 19 -1.27,-1.27; 20 -1.27,1.27; 21 1.27,-1.27; 22 1.27,1.27; 23 3.81,-1.27; 24 3.81,1.27; 25 6.35,-1.27; 26 6.35,1.27; 27 8.89,-1.27; 28 8.89,1.27; 29 11.43,-1.27; 30 11.43,1.27; 31 13.97,-1.27; 32 13.97,1.27; 33 16.51,-1.27; 34 16.51,1.27; 35 19.05,-1.27; 36 19.05,1.27; 37 21.59,-1.27; 38 21.59,1.27; 39 24.13,-1.27; 40 24.13,1.27
PJ-102A = drill 3 pad 4.8: RING 0.1,-3.39; RING_SW -4.6,-6.29; TIP 0.1,-9.29
R0201 = smd 0.28 x 0.43: 1 -0.255,0; 2 0.255,0
PCI-E_64 = drill 0.7 pad 1.27 square: A1 -11.616,1.271 | drill 0.7 pad 1.27: A2 -10.616,3.271; A3 -9.616,1.271; A4 -8.616,3.271; A5 -7.615,1.271; A6 -6.615,3.271; A7 -5.615,1.271; A8 -4.615,3.271; A9 -3.615,1.271; A10 -2.615,3.271; A11 -1.615,1.271; A12 1.385,3.271; A13 2.385,1.271; A14 3.385,3.271; A15 4.385,1.271; A16 5.385,3.271; A17 6.385,1.271; A18 7.385,3.271; A19 8.384,1.271; A20 9.384,3.271; A21 10.384,1.271; A22 11.384,3.271; A23 12.384,1.271; A24 13.384,3.271; A25 14.384,1.271; A26 15.384,3.271; A27 16.384,1.271; A28 17.384,3.271; A29 18.384,1.271; A30 19.384,3.271; A31 20.384,1.271; A32 21.384,3.271; B1 -11.616,-1.229; B2 -10.616,-3.229; B3 -9.616,-1.229; B4 -8.616,-3.229; B5 -7.615,-1.229; B6 -6.615,-3.229; B7 -5.615,-1.229; B8 -4.615,-3.229; B9 -3.615,-1.229; B10 -2.615,-3.229; B11 -1.615,-1.229; B12 1.385,-3.229; B13 2.385,-1.229; B14 3.385,-3.229; B15 4.385,-1.229; B16 5.385,-3.229; B17 6.385,-1.229; B18 7.385,-3.229; B19 8.384,-1.229; B20 9.384,-3.229; B21 10.384,-1.229; B22 11.384,-3.229; B23 12.384,-1.229; B24 13.384,-3.229; B25 14.384,-1.229; B26 15.384,-3.229; B27 16.384,-1.229; B28 17.384,-3.229; B29 18.384,-1.229; B30 19.384,-3.229; B31 20.384,-1.229; B32 21.384,-3.229 | hole 2.15: 0.035,0.021; 23.184,0.021
CRYSTAL-OSC-SMD-5X3 = smd 1.9 x 1.1: 1 -1.85,-1.15; 2 1.85,-1.15; 3 1.85,1.15; 4 -1.85,1.15
QFP50P3000X3000X160-208N = smd 1.475 x 0.3: 1 -14.738,12.75; 2 -14.738,12.25; 3 -14.738,11.75; 4 -14.738,11.25; 5 -14.738,10.75; 6 -14.738,10.25; 7 -14.738,9.75; 8 -14.738,9.25; 9 -14.738,8.75; 10 -14.738,8.25; 11 -14.738,7.75; 12 -14.738,7.25; 13 -14.738,6.75; 14 -14.738,6.25; 15 -14.738,5.75; 16 -14.738,5.25; 17 -14.738,4.75; 18 -14.738,4.25; 19 -14.738,3.75; 20 -14.738,3.25; 21 -14.738,2.75; 22 -14.738,2.25; 23 -14.738,1.75; 24 -14.738,1.25; 25 -14.738,0.75; 26 -14.738,0.25; 27 -14.738,-0.25; 28 -14.738,-0.75; 29 -14.738,-1.25; 30 -14.738,-1.75; 31 -14.738,-2.25; 32 -14.738,-2.75; 33 -14.738,-3.25; 34 -14.738,-3.75; 35 -14.738,-4.25; 36 -14.738,-4.75; 37 -14.738,-5.25; 38 -14.738,-5.75; 39 -14.738,-6.25; 40 -14.738,-6.75; 41 -14.738,-7.25; 42 -14.738,-7.75; 43 -14.738,-8.25; 44 -14.738,-8.75; 45 -14.738,-9.25; 46 -14.738,-9.75; 47 -14.738,-10.25; 48 -14.738,-10.75; 49 -14.738,-11.25; 50 -14.738,-11.75; 51 -14.738,-12.25; 52 -14.738,-12.75; 105 14.738,-12.75; 106 14.738,-12.25; 107 14.738,-11.75; 108 14.738,-11.25; 109 14.738,-10.75; 110 14.738,-10.25; 111 14.738,-9.75; 112 14.738,-9.25; 113 14.738,-8.75; 114 14.738,-8.25; 115 14.738,-7.75; 116 14.738,-7.25; 117 14.738,-6.75; 118 14.738,-6.25; 119 14.738,-5.75; 120 14.738,-5.25; 121 14.738,-4.75; 122 14.738,-4.25; 123 14.738,-3.75; 124 14.738,-3.25; 125 14.738,-2.75; 126 14.738,-2.25; 127 14.738,-1.75; 128 14.738,-1.25; 129 14.738,-0.75; 130 14.738,-0.25; 131 14.738,0.25; 132 14.738,0.75; 133 14.738,1.25; 134 14.738,1.75; 135 14.738,2.25; 136 14.738,2.75; 137 14.738,3.25; 138 14.738,3.75; 139 14.738,4.25; 140 14.738,4.75; 141 14.738,5.25; 142 14.738,5.75; 143 14.738,6.25; 144 14.738,6.75; 145 14.738,7.25; 146 14.738,7.75; 147 14.738,8.25; 148 14.738,8.75; 149 14.738,9.25; 150 14.738,9.75; 151 14.738,10.25; 152 14.738,10.75; 153 14.738,11.25; 154 14.738,11.75; 155 14.738,12.25; 156 14.738,12.75 | smd 0.3 x 1.475: 53 -12.75,-14.738; 54 -12.25,-14.738; 55 -11.75,-14.738; 56 -11.25,-14.738; 57 -10.75,-14.738; 58 -10.25,-14.738; 59 -9.75,-14.738; 60 -9.25,-14.738; 61 -8.75,-14.738; 62 -8.25,-14.738; 63 -7.75,-14.738; 64 -7.25,-14.738; 65 -6.75,-14.738; 66 -6.25,-14.738; 67 -5.75,-14.738; 68 -5.25,-14.738; 69 -4.75,-14.738; 70 -4.25,-14.738; 71 -3.75,-14.738; 72 -3.25,-14.738; 73 -2.75,-14.738; 74 -2.25,-14.738; 75 -1.75,-14.738; 76 -1.25,-14.738; 77 -0.75,-14.738; 78 -0.25,-14.738; 79 0.25,-14.738; 80 0.75,-14.738; 81 1.25,-14.738; 82 1.75,-14.738; 83 2.25,-14.738; 84 2.75,-14.738; 85 3.25,-14.738; 86 3.75,-14.738; 87 4.25,-14.738; 88 4.75,-14.738; 89 5.25,-14.738; 90 5.75,-14.738; 91 6.25,-14.738; 92 6.75,-14.738; 93 7.25,-14.738; 94 7.75,-14.738; 95 8.25,-14.738; 96 8.75,-14.738; 97 9.25,-14.738; 98 9.75,-14.738; 99 10.25,-14.738; 100 10.75,-14.738; 101 11.25,-14.738; 102 11.75,-14.738; 103 12.25,-14.738; 104 12.75,-14.738; 157 12.75,14.738; 158 12.25,14.738; 159 11.75,14.738; 160 11.25,14.738; 161 10.75,14.738; 162 10.25,14.738; 163 9.75,14.738; 164 9.25,14.738; 165 8.75,14.738; 166 8.25,14.738; 167 7.75,14.738; 168 7.25,14.738; 169 6.75,14.738; 170 6.25,14.738; 171 5.75,14.738; 172 5.25,14.738; 173 4.75,14.738; 174 4.25,14.738; 175 3.75,14.738; 176 3.25,14.738; 177 2.75,14.738; 178 2.25,14.738; 179 1.75,14.738; 180 1.25,14.738; 181 0.75,14.738; 182 0.25,14.738; 183 -0.25,14.738; 184 -0.75,14.738; 185 -1.25,14.738; 186 -1.75,14.738; 187 -2.25,14.738; 188 -2.75,14.738; 189 -3.25,14.738; 190 -3.75,14.738; 191 -4.25,14.738; 192 -4.75,14.738; 193 -5.25,14.738; 194 -5.75,14.738; 195 -6.25,14.738; 196 -6.75,14.738; 197 -7.25,14.738; 198 -7.75,14.738; 199 -8.25,14.738; 200 -8.75,14.738; 201 -9.25,14.738; 202 -9.75,14.738; 203 -10.25,14.738; 204 -10.75,14.738; 205 -11.25,14.738; 206 -11.75,14.738; 207 -12.25,14.738; 208 -12.75,14.738
TO252-3L = smd 5.6 x 5.6: P$1 0,0 | smd 1.2 x 2: P$2 -2.25,-7.2; P$3 2.25,-7.2

### Placement (x,y rotation side)
A8_CONN  23,10.5 0 top
AUDIO  38,8.5 90 top
C1  168,81 180 top
C2  164,81 0 top
C3  164,79.5 0 top
C5  16,44 270 top
C6  16,57 90 top
C12  22,44 270 top
C13  30,44 270 top
C15  29,57 90 top
C16  35,57 90 top
C17  36,44 270 top
C18  40.5,48 180 top
C19  21.5,57 90 top
C20  44.5,48 180 top
C44  166,54 180 top
C45  158.5,48.5 180 top
C51  40.5,55 0 top
C52  44.5,55 180 top
C53  69,89.5 0 top
DBG0  19.5,97.5 180 top
DBG1  16.75,97.5 180 top
DBG2  14,97.5 180 top
DBG3  11.25,97.5 180 top
H1  5,5 0 top
H2  5,95 0 top
H3  170,95 0 top
H4  170,5 0 top
IC1  166,85 180 top
IC2  29,76 0 top
IC3  134,71 90 top
IC6  32,50.5 90 top
IC7  18.5,50.5 90 top
IC8  42.5,45.5 0 top
IC9  42.5,52.5 0 top
JP1  5,64 90 top
PJ-102AH  160.5,5.5 180 top
R4  38,44 270 top
R8  45.5,45.5 0 top
R11  45.5,52.5 180 top
R20  16.75,95.5 90 top
R21  19.5,95.5 90 top
R55  11.25,95.5 90 top
R56  14,95.5 90 top
SLOT1  51,16 90 top
SLOT2  71,16 90 top
SLOT3  91,16 90 top
SLOT4  111,16 90 top
SLOT5  131,16 90 top
SLOT6  151,16 90 top
U1  70.5,87 180 top
U$1  93,71 0 top
U$2  166.5,49 270 top

### Tracks (layer width: path | path; a pad name or v marks a point on that pad's centre or on a via)
!EXTSEL!_DIR  (1 unrouted)
!HI_EXTSEL!  (2 unrouted)
!HI_HALT!  (2 unrouted)
!HI_IRQ!  (1 unrouted)
!HI_MPD!  (2 unrouted)
!HI_REF!  (2 unrouted)
!HI_RST!  (2 unrouted)
!MPD!_DIR  (1 unrouted)
+1.2V  (3 unrouted)
+3V3  (15 unrouted)
+5V  (42 unrouted)
AUDIO_L  (1 unrouted)
AUDIO_R  (1 unrouted)
CTRL_DIR  (4 unrouted)
GND  (55 unrouted)
  pour Route2: -4,88 134,88 134,-4 -4,-4
HI_A0  (2 unrouted)
HI_A1  (2 unrouted)
HI_A2  (2 unrouted)
HI_A3  (2 unrouted)
HI_A4  (2 unrouted)
HI_A5  (2 unrouted)
HI_A6  (2 unrouted)
HI_A7  (2 unrouted)
HI_A8  (2 unrouted)
HI_A9  (2 unrouted)
HI_A10  (2 unrouted)
HI_A11  (2 unrouted)
HI_A12  (2 unrouted)
HI_A13  (2 unrouted)
HI_A14  (2 unrouted)
HI_A15  (2 unrouted)
HI_CLK  (2 unrouted)
HI_D0  (2 unrouted)
HI_D1  (2 unrouted)
HI_D2  (2 unrouted)
HI_D3  (2 unrouted)
HI_D4  (2 unrouted)
HI_D5  (2 unrouted)
HI_D6  (2 unrouted)
HI_D7  (2 unrouted)
HI_R/!W!  (2 unrouted)
HI_RD4  (1 unrouted)
HI_RD5  (1 unrouted)
N$3  (1 unrouted)
N$16  (1 unrouted)
N$18  (1 unrouted)
N$19  (1 unrouted)
N$33  (1 unrouted)
VCAP  (1 unrouted)
VDD  (14 unrouted)
VSS  (13 unrouted)